# EAGLE design TG-Watch02B-rev02-order01 (EAGLE 9.6.2)
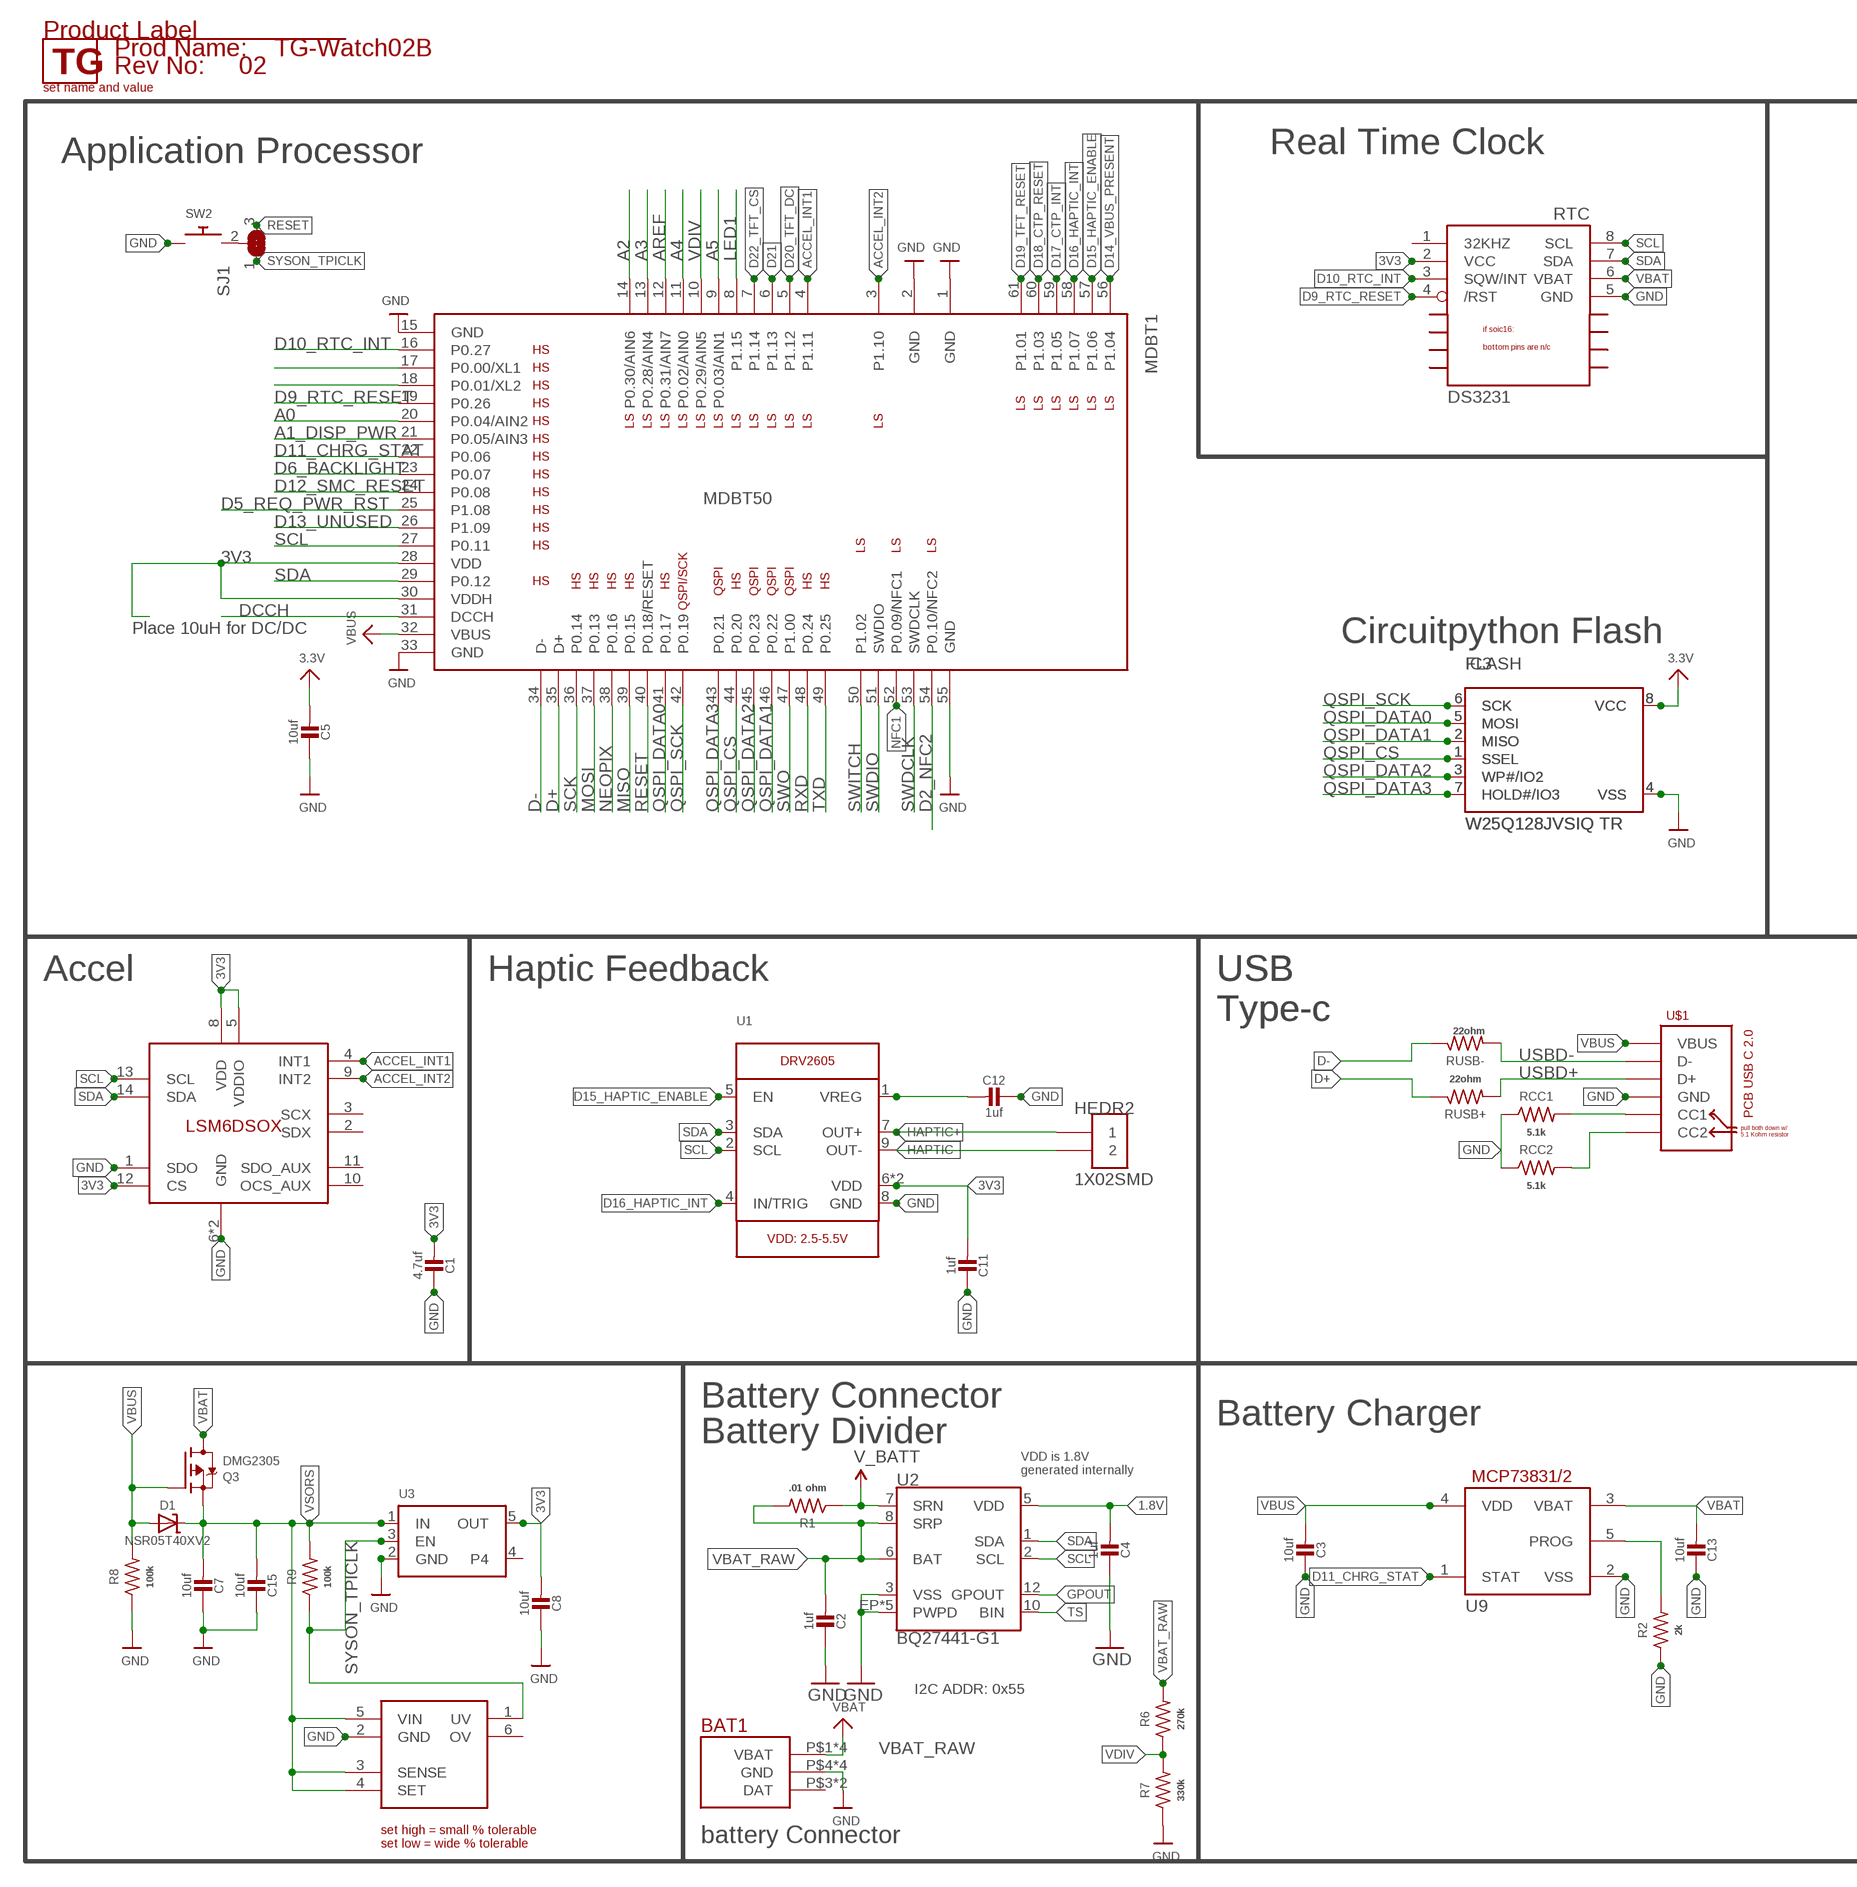
[diagram p0: schematic, sheet 1, part 1 of 2]
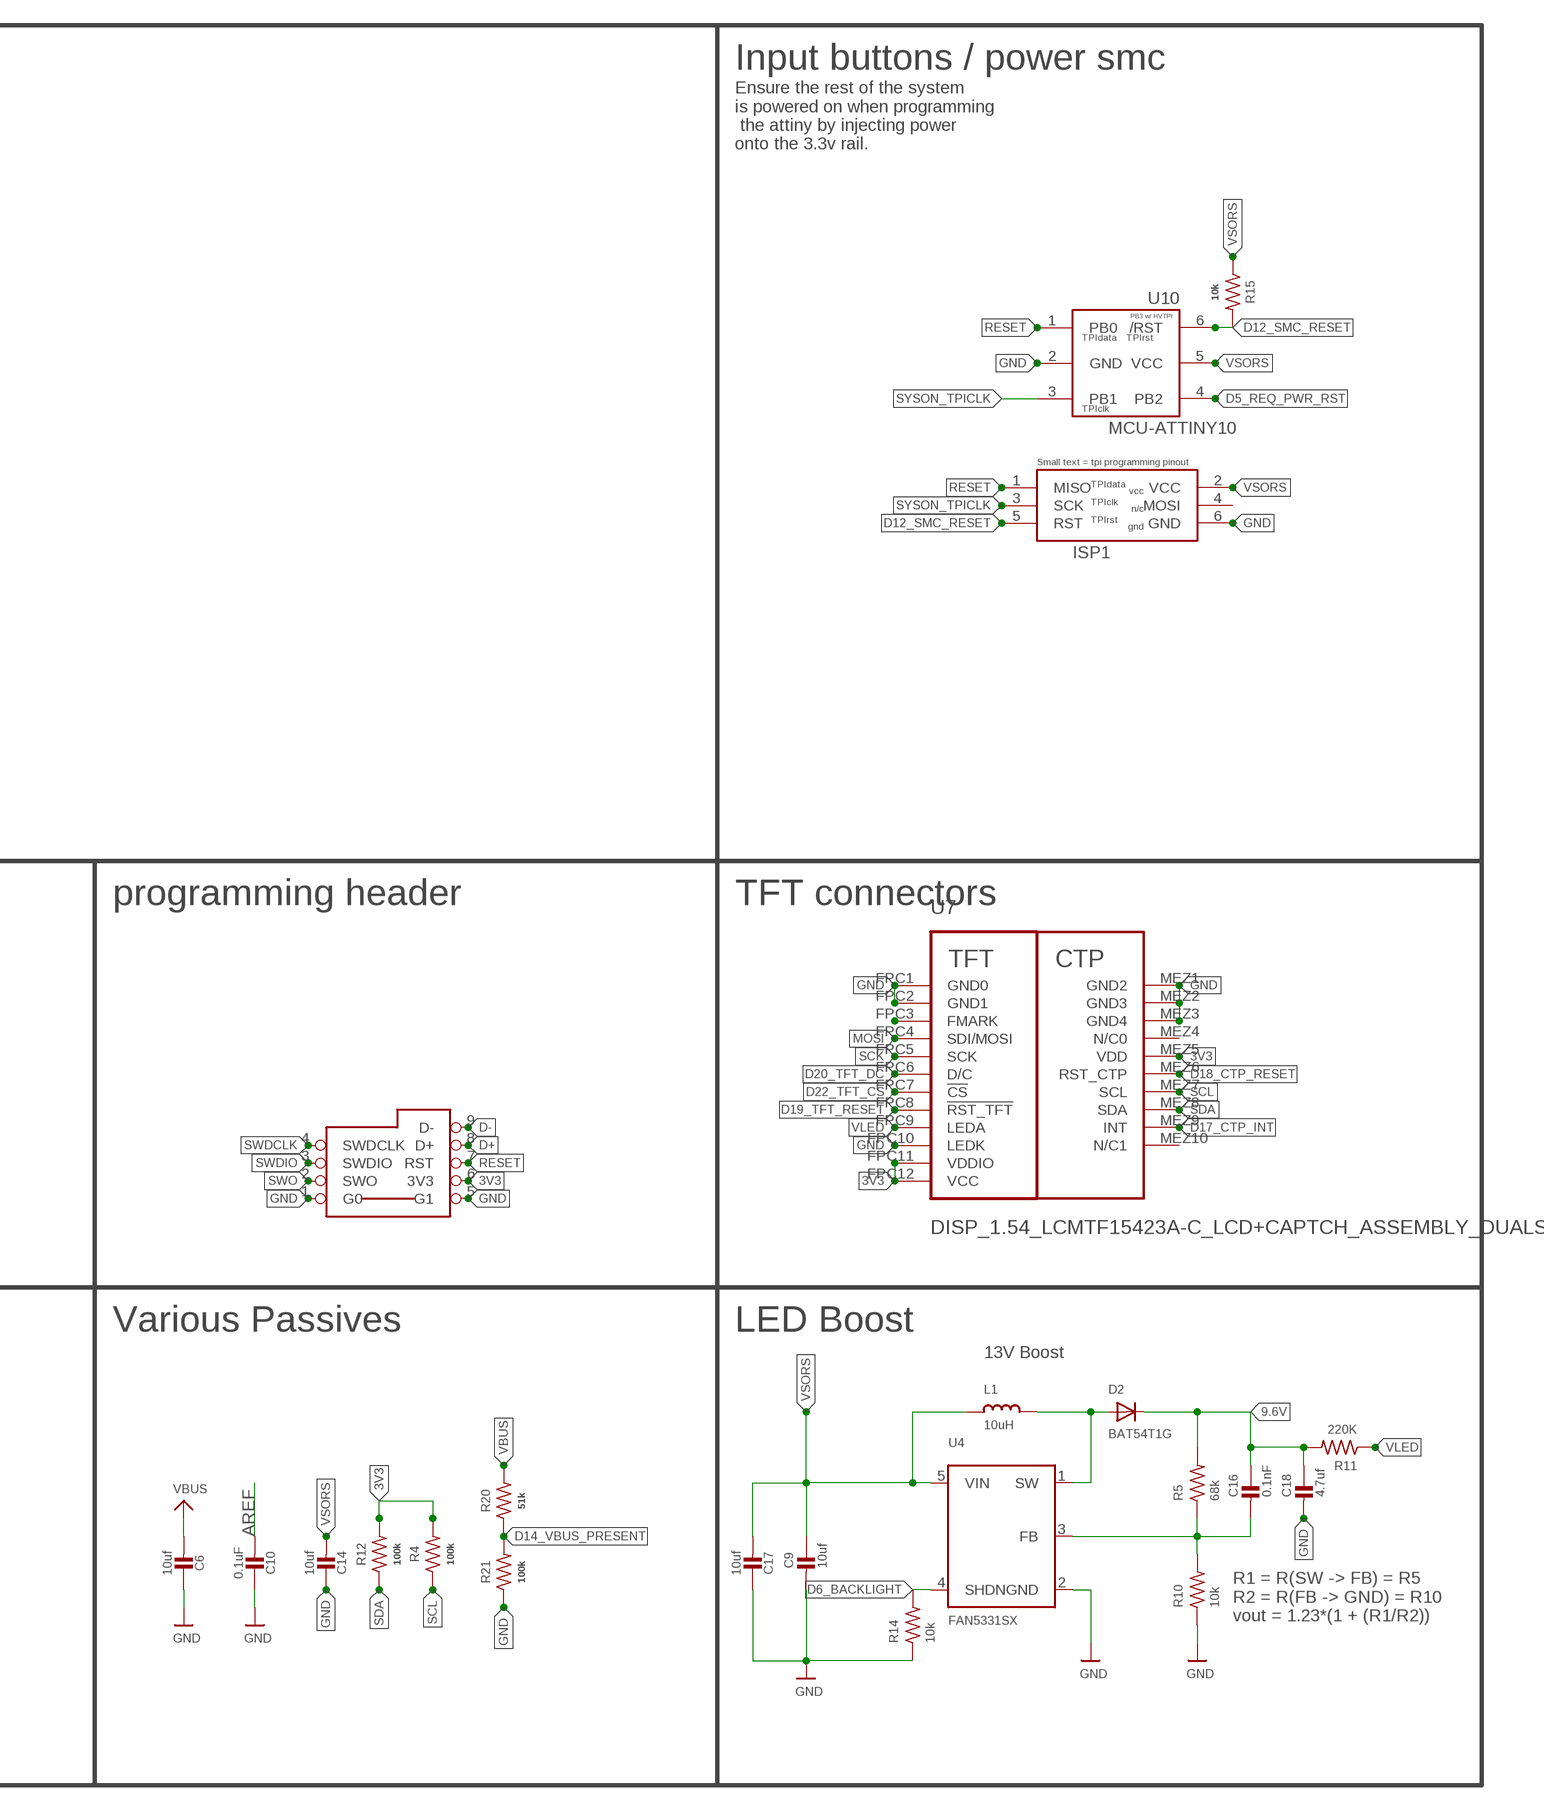
[diagram p1: schematic, sheet 1, part 2 of 2]

## Parts
02  TG-Watch02B  LOGO-TG-PROD-LABEL  [TG-PROD-LABEL-5MM]
ACCEL1  MICROBUILDER_LSM6DSOX  [MICROBUILDER_LGA-14L]
BAT1  CON-BAT-TG-MEZ_FEMALE  [MEZ-DF37NC-10DS]
C1  4.7uf  C-US__0402_NOMASK  [MICROBUILDER__0402_NODIMS]
C2  1uf  C-US__0402_NOMASK  [MICROBUILDER__0402_NODIMS]
C3  10uf  C-US__0402_NOMASK  [MICROBUILDER__0402_NODIMS]
C4  1uf  C-US__0402_NOMASK  [MICROBUILDER__0402_NODIMS]
C5  10uf  C-US__0402_NOMASK  [MICROBUILDER__0402_NODIMS]
C6  10uf  C-US__0402_NOMASK  [MICROBUILDER__0402_NODIMS]
C7  10uf  C-US__0402_NOMASK  [MICROBUILDER__0402_NODIMS]
C8  10uf  C-US__0402_NOMASK  [MICROBUILDER__0402_NODIMS]
C9  10uf  C-US__0402_NOMASK  [MICROBUILDER__0402_NODIMS]
C10  0.1uF  C-US__0402_NOMASK  [MICROBUILDER__0402_NODIMS]
C11  1uf  C-US__0402_NOMASK  [MICROBUILDER__0402_NODIMS]
C12  1uf  C-US__0402_NOMASK  [MICROBUILDER__0402_NODIMS]
C13  10uf  C-US__0402_NOMASK  [MICROBUILDER__0402_NODIMS]
C14  10uf  C-US__0402_NOMASK  [MICROBUILDER__0402_NODIMS]
C15  10uf  C-US__0402_NOMASK  [MICROBUILDER__0402_NODIMS]
C16  0.1nF  C-US__0402_NOMASK  [MICROBUILDER__0402_NODIMS]
C17  10uf  C-US__0402_NOMASK  [MICROBUILDER__0402_NODIMS]
C18  4.7uf  C-US__0402_NOMASK  [MICROBUILDER__0402_NODIMS]
D1  NSR05T40XV2  DIODE-SCHOTTKYSOD-523  [SOD-523]
D2  BAT54T1G  DIODESOD-323  [SOD-323]
FLASH  W25Q128JVSIQ TR  FLASH-SPI-CIRCUIT_PYTHON208MIL  [SOIC8_208MIL]
HEDR2  1X02SMD  [1X2_SMD]
IC3  W25Q128JVSIQ TR  FLASH-SPI-CIRCUIT_PYTHON150MIL  [SOIC8_150MIL]
ISP1  CON-ICSP/ISP-AVR-POGO  [2X3_POGO_AVR]
L1  10uH  INDUCTOR0805  [0805]
MDBT1  MDBT50  [MDBT50]
Q3  DMG2305  MOSFET-P  [SOT23-R]
R1  .01 ohm  R_TG_0402  [TG_0402]
R2  2k  R_TG_0402  [TG_0402]
R4  100k  R_TG_0402  [TG_0402]
R5  68k  R_TG_0402  [TG_0402]
R6  270k  R_TG_0402  [TG_0402]
R7  330k  R_TG_0402  [TG_0402]
R8  100k  R_TG_0402  [TG_0402]
R9  100k  R_TG_0402  [TG_0402]
R10  10k  R_TG_0402  [TG_0402]
R11  220K  R_TG_0402  [TG_0402]
R12  100k  R_TG_0402  [TG_0402]
R14  10k  R_TG_0402  [TG_0402]
R15  10k  R_TG_0402  [TG_0402]
R20  51k  R_TG_0402  [TG_0402]
R21  100k  R_TG_0402  [TG_0402]
RCC1  5.1k  R_TG_0402  [TG_0402]
RCC2  5.1k  R_TG_0402  [TG_0402]
RTC  SEN-TIME-DS3231-(PERSICION-TEMP)  [SOIC8_150MIL]
RUSB+  22ohm  R_TG_0402  [TG_0402]
RUSB-  22ohm  R_TG_0402  [TG_0402]
SJ1  JUMPER_OPEN_2_OP0603  [SOLDERJUMPER_2WAY_OPEN_0603]
SW2  SWITCH_PUSHBUTTONC&K_KSS  [BTN_CK_KSS]
U1  HAPTIC_DRIVER_DRV2605_SOP  [MICROBUILDER_PSOP10]
U2  BQ27441-G1  [PDSO-N12]
U3  VREG_STD_MIN_SOT23-5  [SOT23-5]
U4  FAN5331SX  FAN5331  [SOT23-5@1]
U7  DISP_1.54_LCMTF15423A-C_LCD+CAPTCH_ASSEMBLY_DUALSIDE  [TF-LCM15423A-C_DUALSIDE]
U8  UNDERVOLT-TPS3702CX3  [SOT95P280X110-6N]
U9  MCP73831/OT  [SOT23-5L]
U10  MCU-ATTINY10  [SOT23-6]
U$1  USB-C-CON-TG_MOD-2295018-2.0  [TG_RM_TE_2295018-2]
U$13  CON_SWD_POGO_USB  [SWD_POGO_USB]

## Nets
1.8V: C4.2 U2.5(VDD)
3V3 [power]: ACCEL1.5(VDDIO) ACCEL1.8(VDD) ACCEL1.12(CS) C1.2 C5.2 C8.2 C11.2 FLASH.8(VCC) IC3.8(VCC) MDBT1.28(VDD) MDBT1.30(VDDH) R4.2 R12.2 RTC.2(VCC) U1.6(VDD) U1.10(VDD) U3.5(OUT) U7.FPC11(VDDIO) U7.FPC12(VCC) U7.MEZ5(VDD) U$13.6(3V3) ; supply symbol labelled 3.3V
9.6V: C16.1 C18.1 D2.C R5.2 R11.2
A0: MDBT1.20(P0.04/AIN2)
A1_DISP_PWR: MDBT1.21(P0.05/AIN3)
A2: MDBT1.14(P0.30/AIN6)
A3: MDBT1.13(P0.28/AIN4)
A4: MDBT1.11(P0.02/AIN0)
A5: MDBT1.9(P0.03/AIN1)
ACCEL_INT1: ACCEL1.4(INT1) MDBT1.4(P1.11)
ACCEL_INT2: ACCEL1.9(INT2) MDBT1.3(P1.10)
AREF: C10.2 MDBT1.12(P0.31/AIN7)
BAT_CHRG_SET: R2.2 U9.5(PROG)
CC1: RCC1.2 U$1.A5(CC1)
CC2: RCC2.2 U$1.B5(CC2)
D2_NFC2: MDBT1.54(P0.10/NFC2)
D5_REQ_PWR_RST: MDBT1.25(P1.08) U10.4(PB2)
D6_BACKLIGHT: MDBT1.23(P0.07) R14.2 U4.4(SHDN)
D9_RTC_RESET: MDBT1.19(P0.26) RTC.4(/RST)
D10_RTC_INT: MDBT1.16(P0.27) RTC.3(SQW/INT)
D11_CHRG_STAT: MDBT1.22(P0.06) U9.1(STAT)
D12_SMC_RESET: ISP1.5(RST) MDBT1.24(P0.08) R15.2 U10.6(/RST)
D13_UNUSED: MDBT1.26(P1.09)
D14_VBUS_PRESENT: MDBT1.56(P1.04) R20.1 R21.2
D15_HAPTIC_ENABLE: MDBT1.57(P1.06) U1.5(EN)
D16_HAPTIC_INT: MDBT1.58(P1.07) U1.4(IN/TRIG)
D17_CTP_INT: MDBT1.59(P1.05) U7.MEZ9(INT)
D18_CTP_RESET: MDBT1.60(P1.03) U7.MEZ6(RST_CTP)
D19_TFT_RESET: MDBT1.61(P1.01) U7.FPC8(!RST_TFT)
D20_TFT_DC: MDBT1.5(P1.12) U7.FPC6(D/C)
D21: MDBT1.6(P1.13)
D22_TFT_CS: MDBT1.7(P1.14) U7.FPC7(!CS)
D+: MDBT1.35(D+) RUSB+.1 U$13.8(D+)
D-: MDBT1.34(D-) RUSB-.1 U$13.9(D-)
DCCH: MDBT1.31(DCCH)
DRV_REG: C12.2 U1.1(VREG)
GND: ACCEL1.1(SDO) ACCEL1.6(GND) ACCEL1.7(GND) BAT1.P$4(GND) BAT1.P$5(GND) BAT1.P$9(GND) BAT1.P$10(GND) C1.1 C2.1 C3.1 C4.1 C5.1 C6.1 C7.1 C8.1 C9.2 C10.1 C11.1 C12.1 C13.1 C14.1 C15.1 C17.1 C18.2 FLASH.4(VSS) IC3.4(VSS) ISP1.6(GND) MDBT1.1(GND) MDBT1.2(GND) MDBT1.15(GND) MDBT1.33(GND) MDBT1.55(GND) R2.1 R7.1 R8.1 R10.1 R14.1 R21.1 RCC1.1 RCC2.1 RTC.5(GND) SW2.P$1 U1.8(GND) U2.3(VSS) U2.EP1(PWPD) U2.EP2(PWPD) U2.EP3(PWPD) U2.EP4(PWPD) U2.EP(PWPD) U3.2(GND) U4.2(GND) U7.FPC1(GND0) U7.FPC2(GND1) U7.FPC10(LEDK) U7.MEZ1(GND2) U7.MEZ2(GND3) U7.MEZ3(GND4) U8.2(GND) U9.2(VSS) U10.2(GND) U$1.A1(GND) U$1.A12(GND) U$1.B1(GND) U$1.B12(GND) U$1.P1_1(GND) U$1.P1_2(GND) U$1.P2_1(GND) U$1.P2_2(GND) U$1.P4(GND) U$1.P5(GND) U$13.1(G0) U$13.5(G1)
GPOUT: U2.12(GPOUT)
HAPTIC+: HEDR2.1 U1.7(OUT+)
HAPTIC-: HEDR2.2 U1.9(OUT-)
LED1: MDBT1.8(P1.15)
MISO: MDBT1.39(P0.15)
MOSI: MDBT1.37(P0.13) U7.FPC4(SDI/MOSI)
N$1: U7.FPC3(FMARK)
N$3: C16.2 R5.1 R10.2 U4.3(FB)
N$5: D2.A L1.2 U4.1(SW)
N$6: SJ1.2 SW2.P$2
N$7: MDBT1.17(P0.00/XL1)
N$8: MDBT1.18(P0.01/XL2)
NEOPIX: MDBT1.38(P0.16)
NFC1: MDBT1.52(P0.09/NFC1)
QSPI_CS: FLASH.1(SSEL) IC3.1(SSEL) MDBT1.44(P0.20)
QSPI_DATA0: FLASH.5(MOSI) IC3.5(MOSI) MDBT1.41(P0.17)
QSPI_DATA1: FLASH.2(MISO) IC3.2(MISO) MDBT1.46(P0.22)
QSPI_DATA2: FLASH.3(WP#/IO2) IC3.3(WP#/IO2) MDBT1.45(P0.23)
QSPI_DATA3: FLASH.7(HOLD#/IO3) IC3.7(HOLD#/IO3) MDBT1.43(P0.21)
QSPI_SCK: FLASH.6(SCK) IC3.6(SCK) MDBT1.42(P0.19)
RESET: ISP1.1(MISO) MDBT1.40(P0.18/RESET) SJ1.3 U10.1(PB0) U$13.7(RST)
RXD: MDBT1.48(P0.24)
SCK: MDBT1.36(P0.14) U7.FPC5(SCK)
SCL: ACCEL1.13(SCL) MDBT1.27(P0.11) R4.1 RTC.8(SCL) U1.2(SCL) U2.2(SCL) U7.MEZ7(SCL)
SDA: ACCEL1.14(SDA) MDBT1.29(P0.12) R12.1 RTC.7(SDA) U1.3(SDA) U2.1(SDA) U7.MEZ8(SDA)
SWDCLK: MDBT1.53(SWDCLK) U$13.4(SWDCLK)
SWDIO: MDBT1.51(SWDIO) U$13.3(SWDIO)
SWITCH: MDBT1.50(P1.02)
SWO: MDBT1.47(P1.00) U$13.2(SWO)
SYSON_TPICLK: ISP1.3(SCK) R9.1 SJ1.1 U3.3(EN) U8.1(UV) U10.3(PB1)
TS: U2.10(BIN)
TXD: MDBT1.49(P0.25)
USBD+: RUSB+.2 U$1.A6(D+) U$1.B6(D+)
USBD-: RUSB-.2 U$1.A7(D-) U$1.B7(D-)
VBAT [power]: C13.2 Q3.3(D) R1.1 RTC.6(VBAT) U2.7(SRN) U9.3(VBAT) ; supply symbol labelled V_BATT
VBAT_RAW [power]: BAT1.P$1(VBAT) BAT1.P$2(VBAT) BAT1.P$6(VBAT) BAT1.P$7(VBAT) C2.2 R1.2 R6.2 U2.6(BAT) U2.8(SRP) ; supply symbol labelled VBAT
VBUS [power]: C3.2 C6.2 D1.A MDBT1.32(VBUS) Q3.1(G) R8.2 R20.2 U9.4(VDD) U$1.A4(VBUS) U$1.A9(VBUS) U$1.B4(VBUS) U$1.B9(VBUS)
VDIV: MDBT1.10(P0.29/AIN5) R6.1 R7.2
VLED: R11.1 U7.FPC9(LEDA)
VSORS: C7.2 C9.1 C14.2 C15.2 C17.2 D1.K(C) ISP1.2(VCC) L1.1 Q3.2(S) R9.2 R15.1 U3.1(IN) U4.5(VIN) U8.3(SENSE) U8.4(SET) U8.5(VIN) U10.5(VCC)
Unconnected: ACCEL1.2(SDX) ACCEL1.3(SCX) ACCEL1.10(OCS_AUX) ACCEL1.11(SDO_AUX) BAT1.P$3(DAT) BAT1.P$8(DAT) ISP1.4(MOSI) RTC.1(32KHZ) U3.4 U7.MEZ4(N/C0) U7.MEZ10(N/C1) U8.6(OV)

## Notes on the sheet
- Input buttons / power smc
- Application Processor
- Real Time Clock
- Ensure the rest of the system
  is powered on when programming
   the attiny by injecting power
  onto the 3.3v rail.
- Circuitpython Flash
- Place 10uH for DC/DC
- Accel | Haptic Feedback
- USB
  Type-c
- USB
  Type-c
- programming header | TFT connectors
- Battery Connector | Various Passives | LED Boost
- Battery Charger
- Battery Divider
- 13V Boost
- VDD is 1.8V
  generated internally
- R1 = R(SW -> FB) = R5
  R2 = R(FB -> GND) = R10
  vout = 1.23*(1 + (R1/R2))
- I2C ADDR: 0x55
- battery Connector

## Library data of the parts
02 = 0TG-Lib v01.5:LOGO-TG-PROD-LABEL
ACCEL1 = lsm6dsox_ism330dhc:MICROBUILDER_LSM6DSOX
BAT1 = 0TG-Lib v01.5:CON-BAT-TG-MEZ
C1-C18 = 0TG-Lib v01.5:C-US_: from: microbuilder Ceramic Capacitors For new designs, use the packages preceded by an '_' character since they are more reliable: The following footprints should be used on most boards: _0402 - Standard footprint for regular board layouts _0603 - Standard footprint for regular board layouts _0805 - Standard footprint for regular board layouts _1206 - Standard footprint for regular board layouts For extremely tight-pitch boards where space is at a premium, the following 'micro-pitch' footprints can be used (smaller pads, no silkscreen outline, etc.): _0402MP - Micro-pitch footprint for very dense/compact boards _0603MP - Micro-pitch footprint for very dense/compact boards _0805MP - Micro-pitch footprint for very dense/compact boards _1206MP - Micro-pitch footprint for very dense/compact boards
D1 = microbuilder:DIODE-SCHOTTKY
D2 = microbuilder:DIODE: Diode SMA Model Volts Amps Type Vf Ir Digikey # Notes SSA34-E3 40V 3A Schottky 480mV @ 3A 200uA @ 40V SSA34-E3/61TGITR-ND CDBA120-G 20V 1A Schottky 500mV @ 1A 500uA @ 20V 641-1014-6-ND REEL MBRA210 10V 2A Schottky 350mV @ 2A 700uA @ 10V MBRA210LT3 SOD-123 Model Volts Amps Type Vf Ir Order # Notes BAT54T1G 30V 200mA Schottky 800mV @ 200mA 2uA @ 25V BAT54T1GOSTR-ND B0530W 30V 500mA Schottky 430mV @ 500mA 130uA @ 30V B0530W-FDICT-ND REEL MBR120 20V 1A Schottky 340mV @ 1A MBR120VLSFT1GOSCT-ND SOD-323 Model Volts Amps Type Vf Ir Order # Notes PMEG2005EJ 20V 500mA Schottky 355mV @ 500mA 568-4110-1-ND ZLLS410 10V 570mA Schottky 380mV @ 570mA ZLLS410CT-ND 1N4148WS 75V 150mA Silicon/Simple 1V 1N4148WSFSCT-ND REEL SOD-523 Model Volts Amps Type Vf Ir Order # Notes BAT54XV2 30V 200mA Schottky 0.8V @ 100mA BAT54XV2CT-ND TB751S 30V 30mA Schottky RB751S-40TE61CT-ND SOT23-R/W (R = Solder Paste/Reflow Ovens, W = Hand-Soldering) Model Volts Amps Type Vf Ir Order # Notes BAT54FILM 40V 300mA Schottky 497-7162-1-ND POWERDI-5 Model Volts Amps Type Vf Ir Order # Notes PDS560 60V 5A Schottky 670mV @ 5A 150uA @ 60V PDS560DICT-ND
FLASH IC3 = 0TG-Lib v01.4:FLASH-SPI-CIRCUIT_PYTHON: SOIC8 SPI Flash Be careful with the size since SOIC8 flash comes in several 'widths' SOIC8 150 mil M25P16 - 16Mbit (2Mbit x 8) Serial Flash (75MHz SPI Bus), Supply: 2.7-3.6V Digikey: SOIC8 - M25P16-VMN6P-ND SOIC8 208 mil W25Q16BVSSIG - 16Mbit (2Mbit x 8) Serial Flash (104MHz SPI Bus), Supply: 2.7-3.6V Digikey: SOIC8 - W25Q16BVSSIG-ND from: adafruit availability low
HEDR2 = 0TG-Lib v01.4:1X02
ISP1 = 0TG-Lib v01.5:CON-ICSP/ISP-AVR: AVR ISP HEADER Standard 6 pin header for AVR programming
L1 = microbuilder:INDUCTOR: Inductors 0603: 10nH Ceramic Inductor - microwire antenna/RF (Digikey: 712-1434-2-ND) 0805: 560nH Ceramic Inductor - RF (Digikey: 553-1047-1-ND) 270nH Ceramic Inductor - Q = 40@250MHz, +-5%, 1 Ohm DC Resistance (Digikey: 535-10506-2-ND) 1007 (2518 Metric) SMT: 10µH 10% 250mOhm 820mA 1007 Inductor (Digikey: 587-2189-1-ND) 22µH 10% 500mOhm 580mA 1007 Inductor (Digikey: 587-2190-1-ND) 47µH 10% 950mOhm 420mA 1007 Inductor (Digikey: 587-2191-1-ND) 47µH 5% 100mOhm 1A 1008 Inductor (Digikey: 732-1816-1-ND) 5.0x5.0mm (Taiyo Yuden NR5040 Series) 6.8µH 20% 2.3A 64mOhm Inductor (Digikey: 587-2374-2-ND) 5.0x5.0mm (TDK VLC5045 Series) 4.7µH 20% 3.3A 34mOhm Inductor (Digikey: 445-6526-1-ND) 6.8µH 20% 2.7A 46mOhm Inductor (Digikey: 445-6527-1-ND) 6.0x6.0mm (TDK VLC6045 Series) 4.7µH 20% 3.8A 27mOhm Inductor (Digikey: 445-6538-2-ND) 6.8µH 20% 3A 41mOhm Inductor (Digikey: 445-6540-1-ND) 6.2µH 30% 2.2A 45mOhm Inductor (Digikey: SRR5028-6R2YCT-ND) - Not TDK VLC6045 but footprint should match 6.0x6.0mm (TDK SLF6045 Series) 6.8uH 30% 2A 33mOhm Inductor (Digikey: 445-4572-1-ND, Mouser: 810-SLF645T6R8N2R0PF) 6.0x6.0mm (Sumida CDRH5D28 Series) 6.2uH 30% 1.8A 45mOhm Inductor (Digikey: 308-1542-1-ND) Taiyo Yuden NR3015T2R2M - 2.2uH 20% 1.5A (Digikey: 587-1648-2-ND, Mouser: 963-NR3015T2R2M) - Used with TI TPS62172 CoilCraft RFID Transponder Coil - MA5532-AE (For use with AS3935 Lightning Sensor)
MDBT1 = microbuilder:MDBT50: Raytac Corporation MDBT50 Bluetooth Low Energy Module based on Noridc nRF52840 Source: Raytac datasheet
Q3 = microbuilder:MOSFET-P: P-Channel Mosfet LEGEND VDS: Voltage Drain-Source ID: Drain Current RDS(ON): Drain-Source On-State Resistance VGS(TH): Gate-Source Threshold Voltage CISS: Drain-Source Input Capacitance SOT-23 Name VDS ID RDS(ON) VGS(TH) CISS Order Number IRLML5103 30V 760mA 600 mOhm -- 75pF @ 25V Digikey: IRLML5103PBFCT-ND IRLML6401 12V 4.3A 50 mOhm 950mV @ 250µA 830pF @ 10V Digikey: IRLML6401PBFTR-ND NTR0202PL 20V 400mA 800 mOhm 2.3V @ 250uA 70pF @ 5V Digikey: NTR0202PLT1GOSTR-ND NTR4101PT1G 20V 1.8A 85 mOhm 1.2V @ 250uA 675pF @ 10V Digikey: NTR4101PT1GOSCT-ND DMP2004K 20V 600mA 900 mOhm 1V @ 250uA 175pF @ 16V Digikey: DMP2004KDICT-ND PMV65XP 20V 3.9A 76 mOhm 950mV @ 1mA 725pF @ 20V Digikey: 568-2358-2-ND TO-252 Name VDS ID RDS(ON) VGS(TH) CISS Order Number AOD417 30V 25A 34 mOhm 3V @ 250µA 920pF @ 15V Digikey: 785-1106-2-ND PowerPak Name VDS ID RDS(ON) VGS(TH) CISS Order Number AON7401 30V 12A 14 mOhm 3V @ 250µA 2600pF @ 15V Digikey: 785-1302-1-ND
R1 R2 R4-R12 R14 R15 R20 R21 RCC1 RCC2 RUSB+ RUSB- = 0TG-Lib v01.5:R_TG
RTC = 0TG-Lib v01.5:SEN-TIME-DS3231-(PERSICION-TEMP): from: adafruit altered for this library by: TG-Techie
SJ1 = 0TG-Lib v01.5:JUMPER_OPEN_2_OP: 2-Way Solder Jumper from: microbuilder
SW2 = 0TG-Lib v01.5:SWITCH_PUSHBUTTON: Buttons SOFTTOUCHSMD_SJ - Soft touch temporary push button (Super Junk Akihabara) Compatible with SKPMANE010 [Mouser: 688-SKPMAN] C&K_KSS = Digikey: KSS221GLFS
U1 = 0TG-Lib v01.4:HAPTIC_DRIVER_DRV2605: DRV2605 - Haptic Driver for ERM/LRA Motors
U2 = battery-management-temp:BQ27441-G1; PROD_ID: IC-13220
U3 = 0TG-Lib v01.4:VREG_STD_MIN_SOT23-5: SOT23-5 Fixed Voltage Regulators from: adafruit Part Current Out V Out V In V Dropout θJA (°C/W) TJ (°C) Digikey Part No. ADP121 150mA 3.3V 3.4-5.5V 0.09V @ 150mA -- -- ADP121-AUJZ33R7CT-ND ADP121 150mA 3.0V 3.1-5.5V 0.09V @ 150mA -- -- ADP121-AUJZ30R7CT-ND ADP122 300mA 3.3V 3.4-5.5V 0.085V @ 300mA -- -- ADP122AUJZ-3.3-R7CT-ND ADP1712 300mA 3.3V 3.5-5.5V 0.17V @ 300mA -- -- ADP1712AUJZ-3.3-R7TR-ND AP7311 (Low Cost) 150mA 3.3V 3.5-6V 0.15V @ 150mA -- -- AP7311-33WG-7DICT-ND LD39015M18R 150mA 1.8V 1.9V-5.5V 0.08V @ 100mA -- -- 497-6977-1-ND LP2985A-33DBVR 150mA 3.3V 3.3-16V 0.28V @ 150mA 206 150 296-18479-1-ND MCP1824T-3302E/OT 300mA 3.3V 3.5V-6V 0.2V @ 300mA -- -- MCP1824T-3302E/OTCT-ND MIC5205-2.5YM5 TR 150mA 2.5V 2.7-16V 0.165V @ 150mA -- -- 576-1257-2-ND MIC5205-3.0YM5 TR 150mA 3.0V 3.2V-16V 0.165V @ 150mA -- -- 576-1258-2-ND MIC5205-3.3YM5 TR 150mA 3.3V 3.5V-16V 0.165V @ 150mA -- -- 576-1259-2-ND TPS780330220 150mA 3.3V+2.2V 3.6-5.5V 250mV Max -- -- 296-23332-1-ND TDA3663/N1,135 100mA 3.3V 3.5-45V 0.18V @ 50mA -- -- 568-5343-1-ND Max operating temp can be calculated using θJA, TJ (max junction temperature), and power in watts. Set the "Maximum Ambient Temperature" until it reaches TJ ("Max Junction Temperature"), which is the absolute limit for safe use of the regulator: Heat Sink Temperature Calculator <http://www.daycounter.com/Calculators/Heat-Sink-Temperature-Calculator.phtml> For example, With 12V source into a 3.3V LP2985 and a 30mA load, we are dissipating (12V-3.3V) * 0.03A = 0.261W. With a θJA of 206 °C/W, a TJ of 150°C, and 261mW we can safely use the chip without a heat sink up to 75°C (=147.1°C Junction Temperature).
U4 = microbuilder:FAN5331: FAN5331 - LED/OLED 20V Boost Converter Digikey: FAN5331SXCT-ND
U7 = 0TG-Lib v01.5:DISP_1.54_LCMTF15423A-C_LCD+CAPTCH_ASSEMBLY: FFC/FPC CONNECTOR, RECEPTACLE 12POS 1ROW
U8 = 0TG-Lib v01.4:UNDERVOLT-TPS3702CX3
U9 = 00adafruit:MCP73831: MCP73831/2 Miniature Single-Cell, Fully Integrated Li-Ion, Li-Polymer Charge Management Controllers. Nice and small simple lipoly charge controller, with adjustable current and status output (LED) http://www.ladyada.net/library/pcb/eaglelibrary.html
U10 = 0TG-Lib v01.5:MCU-ATTINY10: ATtiny4/5/9/10 8-bit Microcontroller with 512/1024 Bytes In-System Programmable Flash
U$1 = 0TG-Lib v01.5:USB-C-CON-TG_MOD-2295018-2.0
U$13 = 0TG-Lib v01.5:CON_SWD_POGO_USB

## Net classes
1 power: width 0.254 mm

## Board
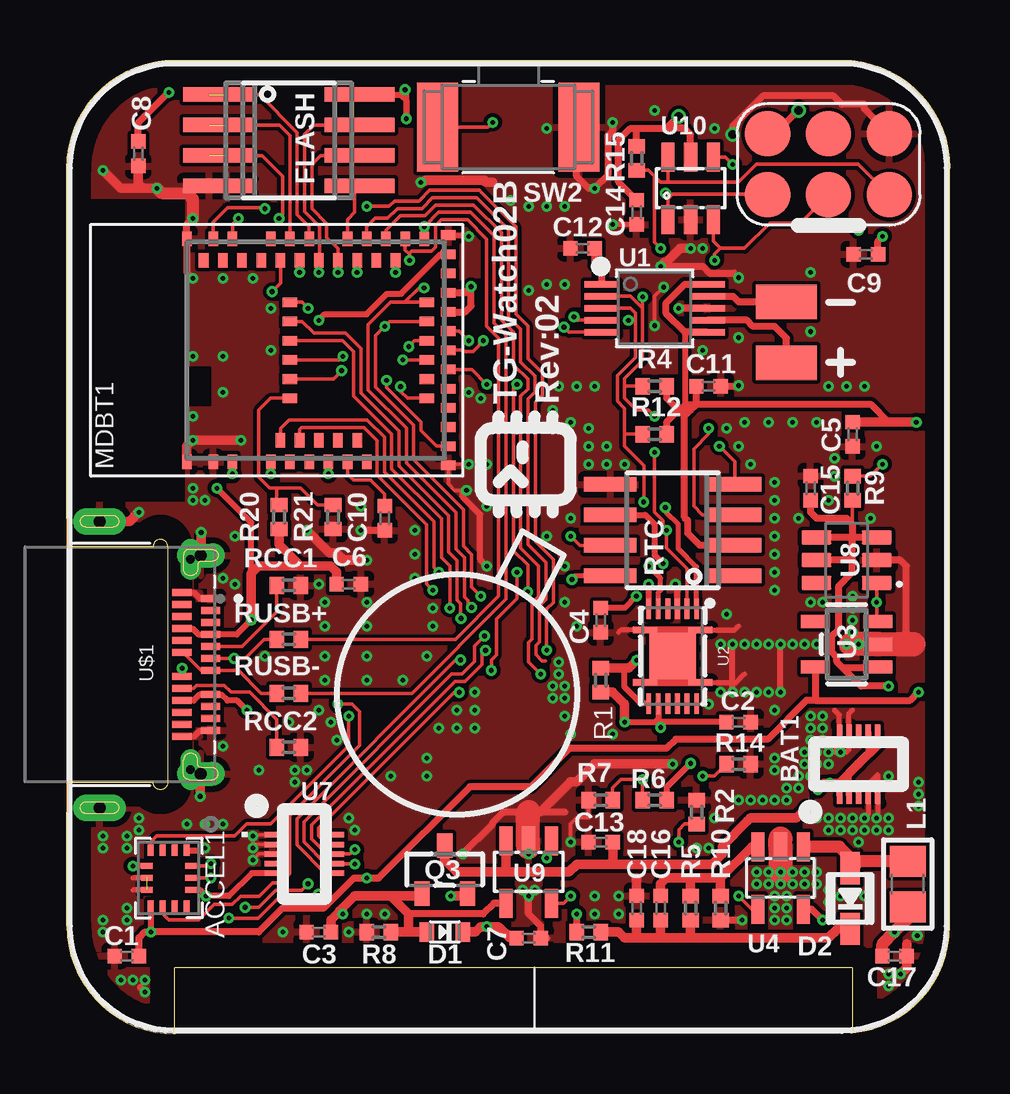
[diagram p2: board, top side]
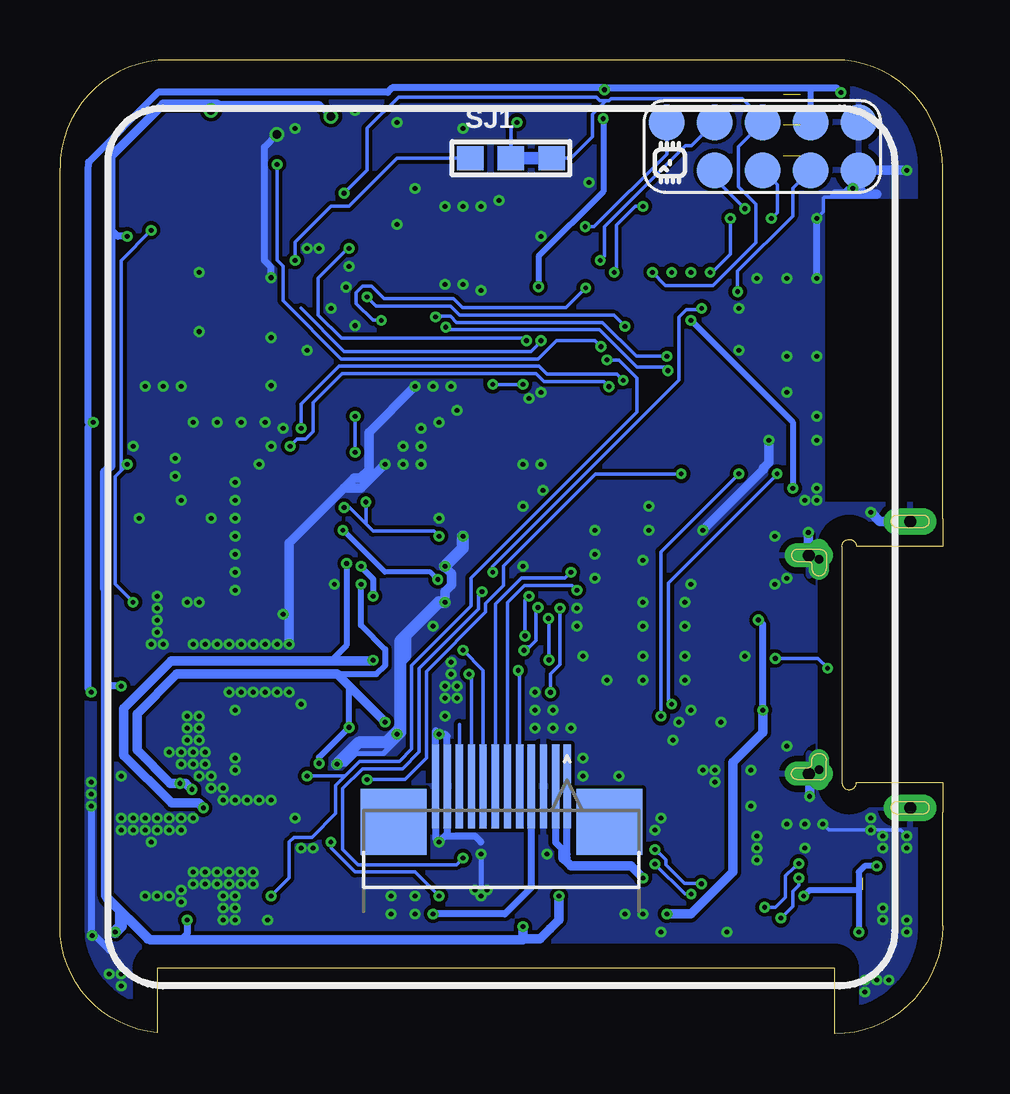
[diagram p3: board, bottom side, seen from below]

Size 36.8 x 40.6 mm. Coordinates in mm from the lower left corner, seen from the top.
Outline: 0,9.23 0,4.5 arc90 4.5,0 4.5,2.75 32.75,2.75 32.75,0.05 arc85 36.8,4.5 36.8,36.1 arc90 32.3,40.6 4.5,40.6 arc90 0,36.1 0,21.49
Copper layers (1*16): Top 0.035mm / dielectric 0.53mm / Bottom 0.035mm
Design rules "default *": minimum track width 6mil, minimum drill 0.2mm, track to track 6mil, track to pad 6mil, pad to pad 6mil, via to via 6mil, smd to smd 6mil, copper to edge 40mil, drill to drill 6mil, minimum pad ring 10mil, minimum via ring 0.125mm, stop-mask expansion 4mil, vias tented up to drill 10000mil, thermal gap 10mil
tRestrict: area 8.3,7.7 to 8.8,8.6; area -0.6,22.2 to 4.9,34.8; area 3,5.8 to 3.8,6.8; area 4.8,7.2 to 5.5,8; area 31.9,12.2 to 32.8,13; area 33.2,9.6 to 34.1,10.3
bRestrict: area -0.6,22.2 to 4.9,34.8; area 20.5,10 to 21.2,10.8

### Footprints (pad centres in the part's own frame; a part is rotated, then mirrored left to right if it is on the bottom)
MICROBUILDER_LGA-14L = smd 0.475 x 0.25: 1 -1.163,0.75; 2 -1.163,0.25; 3 -1.163,-0.25; 4 -1.163,-0.75; 8 1.163,-0.75; 9 1.163,-0.25; 10 1.163,0.25; 11 1.163,0.75 | smd 0.25 x 0.475: 5 -0.5,-0.912; 6 0,-0.912; 7 0.5,-0.912; 12 0.5,0.912; 13 0,0.912; 14 -0.5,0.912
MEZ-DF37NC-10DS = smd 0.23 x 0.63: P$1 -0.8,-1.335; P$2 -0.4,-1.335; P$3 0,-1.335; P$4 0.4,-1.335; P$5 0.8,-1.335; P$6 0.8,1.335; P$7 0.4,1.335; P$8 0,1.335; P$9 -0.4,1.335; P$10 -0.8,1.335
MICROBUILDER__0402_NODIMS = smd 0.6 x 0.6: 1 -0.508,0; 2 0.508,0
SOD-523 = smd 0.8 x 0.6: A 0,-0.75; K 0,0.75
SOD-323 = smd 1.35 x 0.8: A 1.27,0; C -1.27,0
SOIC8_208MIL = smd 0.6 x 2.2: 1 -1.905,-3.315; 2 -0.635,-3.315; 3 0.635,-3.315; 4 1.905,-3.315; 5 1.905,3.315; 6 0.635,3.315; 7 -0.635,3.315; 8 -1.905,3.315
1X2_SMD = smd 1.448 x 2.54: 1 -1.27,0; 2 1.27,0
SOIC8_150MIL = smd 0.6 x 2.2: 1 -1.905,-2.6; 2 -0.635,-2.6; 3 0.635,-2.6; 4 1.905,-2.6; 5 1.905,2.6; 6 0.635,2.6; 7 -0.635,2.6; 8 -1.905,2.6
2X3_POGO_AVR = smd 1.905 x 1.905: 1 -2.54,-1.27; 2 -2.54,1.27; 3 0,-1.27; 4 0,1.27; 5 2.54,-1.27; 6 2.54,1.27
0805 = smd 1.3 x 1.5: 1 -0.95,0; 2 0.95,0
MDBT50 = smd 0.6 x 0.4: 1 -4.65,3.75; 2 -4.65,2.65; 3 -4.65,1.85; 4 -4.65,0.25; 5 -3.75,-0.15; 6 -4.65,-0.55; 7 -3.75,-0.95; 8 -4.65,-1.35; 9 -3.75,-1.75; 10 -4.65,-2.15; 11 -3.75,-2.55; 12 -4.65,-2.95; 13 -3.75,-3.35; 14 -4.65,-3.75; 34 4.65,-6.15; 35 4.65,-5.35; 36 3.75,-4.95; 37 4.65,-4.55; 38 3.75,-4.15; 39 4.65,-3.75; 40 3.75,-3.35; 41 4.65,-2.95; 42 3.75,-2.55; 43 3.75,-1.75; 44 4.65,-1.35; 45 3.75,-0.95; 46 4.65,-0.55; 47 3.75,-0.15; 48 4.65,0.25; 49 3.75,0.65; 50 3.75,1.45; 51 4.65,1.85; 52 3.75,2.25; 53 4.65,2.65; 54 3.75,3.05; 55 4.65,3.75 | smd 0.4 x 0.6: 15 -4.8,-7.15; 16 -4,-7.15; 17 -3.2,-7.15; 18 -2.4,-7.15; 19 -2,-6.25; 20 -1.6,-7.15; 21 -1.2,-6.25; 22 -0.8,-7.15; 23 -0.4,-6.25; 24 0,-7.15; 25 0.4,-6.25; 26 0.8,-7.15; 27 1.2,-6.25; 28 1.6,-7.15; 29 2,-6.25; 30 2.4,-7.15; 31 3.2,-7.15; 32 4,-7.15; 33 4.8,-7.15; 56 -2,-0.55; 57 -1.2,-0.55; 58 -0.4,-0.55; 59 0.4,-0.55; 60 1.2,-0.55; 61 2,-0.55
SOT23-R = smd 0.635 x 1.016: 1 -0.95,-1; 2 0.95,-1; 3 0,1
TG_0402 = smd 0.6 x 0.7: 1 -0.5,0; 2 0.5,0
SOLDERJUMPER_2WAY_OPEN_0603 = smd 1.1 x 1: 1 -1.7,0; 2 0,0; 3 1.7,0
BTN_CK_KSS = smd 1.7 x 3.7: P$1 -2.95,0; P$2 2.95,0
MICROBUILDER_PSOP10 = smd 0.28 x 1.45: 1 -1,-2.2; 2 -0.5,-2.2; 3 0,-2.2; 4 0.5,-2.2; 5 1,-2.2; 6 1,2.2; 7 0.5,2.2; 8 0,2.2; 9 -0.5,2.2; 10 -1,2.2
PDSO-N12 = smd 0.2 x 0.85: 1 -1,-1.975; 2 -0.6,-1.975; 3 -0.2,-1.975; 4 0.2,-1.975; 5 0.6,-1.975; 6 1,-1.975; 7 1,1.975; 8 0.6,1.975; 9 0.2,1.975; 10 -0.2,1.975; 11 -0.6,1.975; 12 -1,1.975 | smd 1.95 x 1.95: EP 0,0 | smd 1 x 0.25: EP1 -1.15,1.1; EP2 -1.15,-1.1; EP3 1.15,-1.1; EP4 1.15,1.1
SOT23-5 = smd 0.55 x 1.2: 1 -0.95,-1.3; 2 0,-1.3; 3 0.95,-1.3; 4 0.95,1.3; 5 -0.95,1.3
SOT23-5@1 = smd 0.55 x 1.2: 1 -0.95,-1.3; 2 0,-1.3; 3 0.95,-1.3; 4 0.95,1.3; 5 -0.95,1.3
TF-LCM15423A-C_DUALSIDE = smd 0.305 x 3.5 bottom: FPC1 2.743,10.317; FPC2 2.261,10.317; FPC3 1.753,10.317; FPC4 1.245,10.317; FPC5 0.762,10.317; FPC6 0.254,10.317; FPC7 -0.254,10.317; FPC8 -0.762,10.317; FPC9 -1.245,10.317; FPC10 -1.753,10.317; FPC11 -2.261,10.317; FPC12 -2.743,10.317 | smd 0.63 x 0.23: MEZ1 -9.835,8.3; MEZ2 -9.835,7.9; MEZ3 -9.835,7.5; MEZ4 -9.835,7.1; MEZ5 -9.835,6.7; MEZ6 -7.165,6.7; MEZ7 -7.165,7.1; MEZ8 -7.165,7.5; MEZ9 -7.165,7.9; MEZ10 -7.165,8.3 | smd 2.75 x 2.75 bottom: MNT0 -4.5,8.85; MNT1 4.5,8.85
SOT95P280X110-6N = smd 1.25 x 0.59: 1 -1.255,0.95; 2 -1.255,0; 3 -1.255,-0.95; 4 1.255,-0.95; 5 1.255,0; 6 1.255,0.95
SOT23-5L = smd 0.55 x 1.2: 1 -0.95,-1.3; 2 0,-1.3; 3 0.95,-1.3; 4 0.95,1.3; 5 -0.95,1.3
SOT23-6 = smd 0.55 x 1.2: 1 -0.95,-1.3; 2 0,-1.3; 3 0.95,-1.3; 4 0.95,1.3; 5 0,1.3; 6 -0.95,1.3
TG_RM_TE_2295018-2 = smd 0.3 x 0.8: A1 -2.75,4.63; A2 -2.25,4.63; A3 -1.75,4.63; A4 -1.25,4.63; A5 -0.75,4.63; A6 -0.25,4.63; A7 0.25,4.63; A9 1.25,4.63; A10 1.75,4.63; A11 2.25,4.63; A12 2.75,4.63; B1 3,3.43; B2 2.5,3.43; B3 2,3.43; B4 1.5,3.43; B5 1,3.43; B6 0.5,3.43; B7 -0.5,3.43; B8 -1,3.43; B9 -1.5,3.43; B10 -2,3.43; B11 -2.5,3.43; B12 -3,3.43 | drill 0.5 long: P1_1 -4.55,4.22; P2_1 4.55,4.22 | drill 0.35 long: P1_2 -4.391,3.795; P2_2 4.391,3.795 | drill 0.5 pad 1.1 long: P4 -5.97,0; P5 5.97,0
SWD_POGO_USB = smd 1.5 x 1.5: 1 -1,-4; 2 -1,-2; 3 -1,0; 4 -1,2; 5 1,-4; 6 1,-2; 7 1,0; 8 1,2; 9 1,4

### Placement (x,y rotation side)
02  19.25,23.75 90 top
ACCEL1  4.25,6.5 270 top
BAT1  33,11.25 0 top
C1  2.5,3.25 0 top
C2  28,13 180 top
C3  10.5,4.25 0 top
C4  22.25,17.25 90 top
C5  32.75,25 90 top
C6  11.75,18.75 180 top
C7  19.25,4 180 top
C8  2.98,36.69 90 top
C9  33.3,32.5 180 top
C10  13.25,21.5 90 top
C11  26.75,27 180 top
C12  21.5,32.75 0 top
C13  22.25,8 0 top
C14  23.75,34.25 90 top
C15  31,22.75 270 top
C16  24.75,5.25 90 top
C17  34.5,3.25 180 top
C18  23.75,5.25 90 top
D1  15.75,4.25 270 top
D2  32.65,5.65 90 top
FLASH  9.25,37.25 270 top
HEDR2  30,29.25 90 top
IC3  9.25,37.25 270 top
ISP1  31.75,36.25 0 top
L1  35.05,6.25 90 top
MDBT1  8.75,28.5 90 top
Q3  15.75,6.85 0 top
R1  22.25,14.75 270 top
R2  26.25,9.25 270 top
R4  24.5,27 0 top
R5  26,5.25 270 top
R6  24.5,9.75 0 top
R7  22.25,9.75 0 top
R8  13,4.25 0 top
R9  32.75,22.75 270 top
R10  27.25,5.25 90 top
R11  21.75,4.25 0 top
R12  24.5,25 0 top
R14  28,11.25 180 top
R15  23.75,36.5 270 top
R20  8.85,21.55 270 top
R21  11.1,21.55 90 top
RCC1  9.25,18.7 180 top
RCC2  9.25,11.95 180 top
RTC  25.25,21 90 top
RUSB+  9.25,16.45 180 top
RUSB-  9.25,14.2 180 top
SJ1  18,36.5 0 bottom
SW2  18.4,37.8 180 top
U1  24.5,30.25 270 top
U2  25.25,15.75 180 top
U3  32.5,16.25 90 top
U4  29.75,6.5 180 top
U7  18.4,0 0 top
U8  32.5,19.75 180 top
U9  19.25,6.75 180 top
U10  26,35.25 0 top
U$1  1.36,15.4 270 top
U$13  7.5,37 90 bottom

### Tracks (layer width: path | path; a pad name or v marks a point on that pad's centre or on a via)
1.8V  (via drill 0.2)
  Top 0.2: U2.5 24.65,18.4 24.75,18.5 24.75,19 v24.25,19.5
  Top 0.254: v23.75,18.25 23.26,17.76 C4.2
  Bottom 0.254: v24.25,19.5 24.25,19.46 23.75,18.96 v23.75,18.25
3V3  (via drill 0.2)
  Top 0.254: 13.9,39.16 v14.1,39.36 14.15,39.31 v14.15,38.15 14.15,38.9 13.9,39.16 | ACCEL1.8 v3.5,4.25 | ACCEL1.5 v2.75,7 | ACCEL1.12 5.55,6 v5.8,5.75 6.75,5.75 7.7,6.7 U7.MEZ5 | 25.75,29.25 25.75,26.25 | 26,26 25.75,26.25 | 25.75,26.25 26.24,26.25 26.24,26.24 | 13.9,39.16 IC3.8 FLASH.8
  Top 0.3: C1.2 3.01,4.01 3.25,4.25 v3.5,4.25 8,4.25 9,5.25 10.72,5.25 11.97,6.5 v12.5,6.5 13,6.5 16.8,10.3 19.34,10.3 20.94,11.9 25,11.9 25.38,12.29 29.21,12.29 30.83,13.9 31.2,13.9 | C8.2 2.98,37.98 v4.25,39.25 | U1.6 25.75,29.25 24.97,30.03 24.97,30.47 25.75,31.25 U1.10 | 34.25,25.51 33.51,26.25 26.25,26.25 26.24,26.24 | 31.2,13.9 35.15,13.9 v35.5,14.25 | U3.5 31.2,13.9 | R12.2 25,25.5 25.5,26 25,26.5 R4.2 | 25.75,26 26,26 | MDBT1.28 16.6,30.1 16.85,30.35 v16.85,31.15 16.6,30.9 MDBT1.30 | RTC.2 26.39,20.36 25.88,20.87 25.88,21.4 25.75,21.54 25.75,25.75 26,26 | 26,26 26.24,26.24 | 26.24,26.24 C11.2
  Top 0.4: C5.2 34.25,25.51 v35.4,25.51 v35.41,25.5
  Top 0.5: 25.5,26 25.75,26
  Bottom 0.254: v2.75,7 3.25,7 3.5,6.75 3.5,6 | 3.5,6 v3.5,4.25 | v5.8,5.75 5.55,6 3.5,6 | v16.85,31.15 16.85,32.41 14.15,35.11 v14.15,38.15 | U$13.6 5.5,39.43
  Bottom 0.3: 15.75,7.25 15.66,7.34 15.66,7.5 | 15.66,7.5 U7.FPC12 | U7.FPC11 16.14,7.98 15.83,7.67 15.66,7.5 | v4.25,39.25 4.43,39.43 4.5,39.43 5.5,39.43 14.03,39.43 v14.1,39.36 14.18,39.43 22.96,39.43 23.14,39.25 32.71,39.25 35.61,36.35 35.63,36.1 35.63,25.55 35.58,25.5 | v35.5,14.25 35.63,14.38 35.63,25.28 v35.41,25.5
  Bottom 0.4: v12.5,6.5 13,7 15.5,7 15.75,7.25 15.83,7.33 15.83,7.67 | v35.41,25.5 35.58,25.5
9.6V
  Top 0.4: R11.2 23,4.25 23.25,4 23.75,4 | 24.75,4 26,4 | 24.75,4 23.75,4 | C18.1 23.75,4 | C16.1 24.75,4 | R5.2 26,4 | D2.C 32.13,4.38 31.75,4 26,4
ACCEL_INT1  (via drill 0.2)
  Top 0.152: ACCEL1.4 3.5,8 3.75,8.25 5.5,8.25 7,8.25 7.5,8.75 8.5,8.75 11.75,12 v11.75,13.25 | MDBT1.4 v8.5,23.35
  Bottom 0.152: v8.5,23.35 11.75,20.1 v11.75,13.25
ACCEL_INT2  (via drill 0.2)
  Top 0.152: ACCEL1.9 4,5 4.25,4.75 5.5,4.75 6.14,5.39 6.9,5.39 7.24,5.74 8.02,5.74 8.57,6.29 8.91,6.29 9.28,6.66 9.28,9.1 12.2,12.02 12.2,13.43 11.89,13.75 v11.3,13.75 | MDBT1.3 v6.9,23.35
  Bottom 0.152: v6.9,23.35 11.45,18.8 11.45,13.89 v11.3,13.75
AREF
  Top 0.152: MDBT1.12 11.7,23.35 11.95,23.1 12.65,23.1 13.25,22.5 C10.2
BAT_CHRG_SET  (via drill 0.2)
  Top 0.152: U9.5 20.7,5.45 v21,5.75 | v25.5,8 25.5,8.5 25.75,8.75 R2.2
  Bottom 0.152: v21,5.75 22,6.75 24.5,6.75 25.5,7.75 v25.5,8
CC1
  Top 0.152: RCC1.2 8.75,17.6 7.45,16.3 7.3,16.15 U$1.A5
CC2
  Top 0.152: RCC2.2 8.75,13.12 7.62,14.25 6.84,14.25 6.56,14.53 5.42,14.53 5.29,14.4 U$1.B5
D5_REQ_PWR_RST  (via drill 0.2)
  Top 0.152: MDBT1.25 14.5,28.9 v14.25,28.65 | v27.75,36.25 27.45,36.55 U10.4
  Bottom 0.152: v14.25,28.65 14.5,28.9 16.11,28.9 16.87,28.14 25.07,28.14 27.5,30.57 27.5,32 27.75,32.25 v27.75,36.25
D6_BACKLIGHT  (via drill 0.2)
  Top 0.152: MDBT1.23 v14,28.1 | R14.2 27,10.75 v26.5,10.75 | U4.4 28.55,5.2 v28,5.75
  Bottom 0.152: v14,28.1 13.5,28.1 12.75,27.35 12.75,25.93 19.67,19.02 19.67,17.84 22.13,15.37 22.13,11.88 22.65,11.36 24.31,11.36 24.93,10.75 | v28,5.75 27.25,6.5 27.25,8 27.05,8.2 26.3,8.2 25.31,9.19 25.31,10.36 24.93,10.75 | v26.5,10.75 24.93,10.75
D9_RTC_RESET  (via drill 0.2)
  Top 0.152: MDBT1.19 14.19,26.5 13.91,26.78 v13.91,26.99 | RTC.4 27.85,23.85 v27.2,24.5
  Bottom 0.152: v13.91,26.99 14.12,27.2 16.63,27.2 16.96,27.53 25.04,27.53 26.25,26.32 26.25,25.11 26.56,24.8 26.91,24.8 v27.2,24.5
D10_RTC_INT  (via drill 0.2)
  Top 0.152: MDBT1.16 15.4,24.5 14.76,25.14 14.76,25.5 13.32,26.94 v13.32,27.25 | v26.75,25.25 26.75,25 26.13,24.38 26.13,22 26.49,21.64 RTC.3
  Bottom 0.152: v13.32,27.25 13.57,27.5 16.5,27.5 16.84,27.84 25.16,27.84 26.75,26.25 v26.75,25.25
D11_CHRG_STAT  (via drill 0.2)
  Top 0.152: U9.1 20.2,7.53 v20,7.33 | v19.21,18.43 19.21,19.54 18.61,20.14 18.61,26.93 v18.76,27.08 | v17.5,27.08 16.88,27.7 MDBT1.22
  Bottom 0.152: v20,7.33 20.27,7.05 24.37,7.05 25.01,7.69 25.01,10.23 24.19,11.06 22.52,11.06 21.83,11.75 21.83,15.24 19.66,17.41 19.54,17.54 19.36,17.71 19.36,18.28 v19.21,18.43 | v18.76,27.08 v17.5,27.08
D12_SMC_RESET  (via drill 0.2)
  Top 0.152: v17.35,28.9 17.2,28.75 17.2,28.71 16.94,28.45 16.56,28.45 16.51,28.5 MDBT1.24 | ISP1.5 34.75,34.52 34.75,34.5 33,36.25 28.75,36.25 28,35.5 25,35.5 | R15.2 24.25,36 24.5,35.75 | 24.5,35.75 24.75,35.5 25,35.5 | U10.6 25.05,35.55 25,35.5 | v24.75,32.75 24.5,33 24.5,35.75
  Bottom 0.152: v17.35,28.9 17.45,29 25.07,29 26.03,29.97 26.03,31.5 24.78,32.75 v24.75,32.75
D13_UNUSED  (via drill 0.2)
  Top 0.152: MDBT1.26 16.35,29.3 v16.75,28.9
  Bottom 0.152: 26.75,30.25 24.95,28.45 17.16,28.45 16.9,28.71 16.9,28.75 v16.75,28.9
D14_VBUS_PRESENT
  Top 0.152: R21.2 10.45,22.05 9.75,22.75 8.75,22.75 | MDBT1.56 8.5,26.5 8,26 8,23.21 8.46,22.75 8.75,22.75 | R20.1 8.75,22.15 8.75,22.75
D15_HAPTIC_ENABLE  (via drill 0.2)
  Top 0.152: MDBT1.57 11.11,27.3 v11.45,27.65 | v20.72,29.47 20.93,29.25 U1.5
  Bottom 0.152: v11.45,27.65 11.6,27.8 12.76,27.8 14.31,29.35 20.6,29.35 v20.72,29.47
D16_HAPTIC_INT  (via drill 0.2)
  Top 0.152: MDBT1.58 11.35,28.1 v11.5,28.25 | v21.14,29.89 21.28,29.75 U1.4
  Bottom 0.152: v11.5,28.25 12.78,28.25 14.19,29.66 20.27,29.66 20.53,29.92 20.9,29.92 20.93,29.89 v21.14,29.89
D17_CTP_INT  (via drill 0.2)
  Top 0.152: U7.MEZ9 10.85,7.9 10.5,8.25 10.5,8.6 16.15,14.24 v16.36,14.24 | MDBT1.59 11.49,28.9 11.95,28.44 11.95,26.58 13.54,25 13.54,23.55 15.61,21.48 15.61,19.85 15.96,19.5 v15.96,17.75
  Bottom 0.152: v16.36,14.24 16.36,15 15.96,15.4 v15.96,17.75
D18_CTP_RESET  (via drill 0.2)
  Top 0.152: U7.MEZ6 10.76,6.7 9.59,7.87 9.59,8.97 16.2,15.59 v16.41,15.59 | MDBT1.60 9.8,29.7 10.29,29.2 11.62,29.2 12.26,28.56 12.26,26.71 13.84,25.12 13.84,23.68 15.91,21.61 15.91,20.09 16.27,19.73 16.27,18.09 16.41,17.94 16.41,17.34 v16.43,17.32
  Bottom 0.152: v16.41,15.59 16.41,17.3 v16.43,17.32
D19_TFT_RESET  (via drill 0.2)
  Top 0.152: MDBT1.61 9.8,30.5 v10.05,30.25 | v17.69,15.16 17.69,15.58 17.91,15.8 17.91,17.3 18.76,18.15 v18.76,19.25
  Bottom 0.152: v10.05,30.25 10.1,30.2 10.69,30.2 11,29.89 11,27.25 18.5,19.75 18.76,19.49 v18.76,19.25 | U7.FPC8 17.64,15.1 v17.69,15.16
D20_TFT_DC  (via drill 0.2)
  Top 0.152: MDBT1.5 8.9,25.23 9.25,25.58 12.52,25.58 13.23,24.87 13.23,23.43 15.3,21.36 15.3,19.45 v15.5,19.25
  Bottom 0.152: v15.5,19.25 15.74,19.01 17.56,19.01 18.65,17.92 U7.FPC6
D22_TFT_CS  (via drill 0.2)
  Top 0.152: MDBT1.7 9.7,25.2 9.78,25.28 12.39,25.28 12.93,24.75 12.93,23.3 15,21.23 15,18.75 v15.25,18.5
  Bottom 0.152: U7.FPC7 18.15,18 17.44,18.7 15.45,18.7 v15.25,18.5
D+  (via drill 0.2)
  Top 0.152: MDBT1.35 14.1,32.67 14.28,32.5 v14.28,32.25 14.28,32.53 14.37,32.62 15.2,32.62 15.37,32.8 15.37,33.69 15.63,33.95 16.7,33.95 17.5,33.14 17.5,29.5 18,29 18,18.25 16.2,16.45 RUSB+.1
  Bottom 0.152: U$13.8 10.48,37.02 10.73,37.02 14.1,33.65 14.1,32.43 v14.28,32.25
D-  (via drill 0.2)
  Top 0.152: MDBT1.34 v14.9,33.65 15.5,34.25 16.82,34.25 17.8,33.27 17.8,29.63 18.3,29.13 18.3,18.12 14.38,14.2 RUSB-.1
  Bottom 0.152: U$13.9 11.5,36.68 14.53,33.65 v14.9,33.65
DRV_REG
  Top 0.3: C12.2 22,32.05 22.3,31.75 U1.1
GND  (via drill 0.2, 0.35)  (1 unrouted)
  Top 0.152: U7.MEZ3 8,7.5 v7.75,7.25 | U7.MEZ2 7.85,7.9 7.75,8 | U7.MEZ1 7.7,8.3 | v21,8 21,8.75 21.25,9 21.75,9 R7.1 | v16.75,23.75 15.95,23.75 MDBT1.15 15.9,22.92 16.16,22.66 16.5,22.66 | v24.5,29.53 24.5,30.75 v24.88,31.13
  Top 0.2: 33.8,9.17 BAT1.P$5 33.8,10.8 33.4,10.4 BAT1.P$4 33.4,9.15 | 32.5,11.75 32.6,11.85 BAT1.P$9 32.6,13.35 32.75,13.5 | 32,11.75 32.2,11.95 BAT1.P$10 32.2,13.3 32,13.5 | ACCEL1.6 2.75,6.5 | ACCEL1.7 2.75,6 | MDBT1.33 16.7,33.3 v16.75,33.25 | U2.EP1 27.9,14.65 28.25,15 | U2.EP2 27.85,16.85 28,17 | U2.EP3 23.1,16.85 23,16.75 | U2.EP4 25.15,14.65 25.25,14.75 U2.EP | C14.1 v22.76,33.74 v22.75,33.75
  Top 0.254: ACCEL1.1 5.66,7.66 v5.75,7.75 | v17.5,19.5 17.23,19.77 17.23,21.66 16.5,22.39 16.5,22.66 | U2.3 25.45,18.66 v25.36,18.75 | v27.75,14.25 v27.75,16.25 | v29.75,14.25 v29.75,16.25 | U$1.B1 5.3,12.4 5.55,12.65 U$1.A12 | U$1.B12 5.3,18.4 5.55,18.15 U$1.A1
  Top 0.3: 3.06,1.94 v3.25,1.75 | v5.25,34 5,33.75 MDBT1.55 5,31.75 v5.25,31.5 | U3.2 34.5,16.25 35,16.75 35,19.5 34.75,19.75 U8.2 | v16.5,7.5 17.72,8.72 17.72,8.78 18.2,9.25 19.25,9.25 19.75,9.25 20.75,9.25 | v19.25,5.75 19.25,5 19.76,4.49 C7.1 20.01,4 | U1.8 v25.5,30.25 | C10.1 v12.26,20.99 v12.25,21 | v28,27.03 28.04,27.03 28.01,27 C11.1 | R10.1 v28.15,4.75 | ISP1.6 33.25,38.56 33.25,38.75 32.3,38.75 31.94,39.1 29.02,39.1 27.75,37.84 v27.75,37.5 | SW2.P$1 21.25,37.7 21.25,35.75 21.75,35.25 v22,35.25 22.55,35.8 22.55,37.44 22.75,37.64 v22.75,38 | v24.75,32 26.5,32 26.78,31.72 27.8,31.72 v28,31.53
  Top 0.4: C18.2 23.75,6.5 | v1.5,36 2.25,35.25 v3.75,35.25 3.16,35.25 2.98,35.43 C8.1 | v10,21 10.95,20.05 11.23,20.05 11.53,19.75 v12.5,19.75 | v7.25,24.75 v5.25,24.75 5,24.5 MDBT1.1 | v25.25,11.25 22,11.25 21.25,10.5 21,10.5 19.75,9.25 | 17.75,35.5 17.47,35.5 17.38,35.59 14.94,35.59 14.85,35.5 v14.75,35.5 | U$1.P2_2 5.55,10.81 v5.55,9.9 | U$1.P1_2 5.6,20.04 v5.6,20.9 | v3,21.75 2.62,21.37 U$1.P4 | v24.75,32 24.92,32.17 24.99,32.17 25.57,32.75 v26,32.75 | v34.75,2.5 35.01,2.76 C17.1 35.01,3.76
  Top 0.5: v3.75,35.25 3.95,35.05 5,35.05 5.25,34.8 v5.25,34
  Top 1: 19.23,7.8 19.23,9.23 19.25,9.25 | U3.2 35.28,16.25 | U3.2 33.55,16.25 | U3.2 32.69,16.25 | v29.75,6.75 U4.2 29.75,8.15
  Bottom 0.152: v1.5,8.25 1.75,8.5 4.75,8.5 v5,8.75 | v3.75,35.25 4,35.25 4.37,34.88 4.93,34.88 4.98,34.83 4.98,34.27 v5.25,34 | v24.88,31.13 v24.87,31.13 24.75,31.25
  Bottom 0.2: v19.25,7.5 v19.25,5.75 | v25.25,11.25 24.89,11.25 24.45,11.69 23.31,11.69 22.46,12.54 22.46,15.51 22.25,15.72 C4.1
  Bottom 0.3: 20.75,12.5 20.66,12.41 U7.FPC2 20.66,8.34 v21,8 | 21.14,12.64 U7.FPC1 21.14,8.14 v21,8 | 19.25,8 19.5,8.25 20.75,8.25 v21,8 | v35.5,9.5 35.5,4.25 34.75,3.5 | v5.25,31.5 v5.25,34 | v28,31.53 28,31.96 28.28,32.24 28.28,36.97 v27.75,37.5
  Bottom 0.4: v23.25,23.75 24.25,22.75 24.96,22.75 | 24.96,22.75 27.25,20.46 v27.25,16.25 | v22,27 23.92,25.08 23.92,23.51 24.26,23.17 24.54,23.17 24.96,22.75 | v1.5,36 U$13.1 3.5,35.25 3.25,35 | v20.75,18 20.75,18.43 20.47,18.71 20.47,19.19 20.75,19.46 v20.75,19.5 | v10,21 7.48,23.52 7.48,23.59 7.25,23.82 v7.25,24.75 | 3.25,35 2.75,35 | 3.25,35 4.5,35 | U$1.P1_2 5.6,20.04 v5.6,20.9 | U$1.P2_2 5.55,10.81 v5.55,9.9 | U$1.P4 2.62,21.37 v3,21.75
  Bottom 0.5: v25.25,11.25 24.35,12.15 23.21,12.15 22.62,12.74 22.62,16.38 C4.1 21,18 v20.75,18 | v20.75,19.5 20,20.25 v20,20.75
  other vias: 23,5.75 13.25,5 9,4.25 11.75,4.25 12.5,5 7.75,8.25 7.75,7.75 31.75,11.75 35.5,10 15,10.75 15,11.5 28,29.03 31,29.28 26.25,7.75 27,9 26.75,7.75 23,5 22,5 22,5.75 31.25,11.75 31.75,11.25 31.25,11.25 30.75,11.75 31,10.75 31.5,12.25 12.25,22 16.66,22.66 17.5,22 17,13.5 16.25,13.5 17,14.25 10.75,14.75 20.5,15.5 10.75,15.75 12.5,15.75 12.5,14.75 14,14.75 15,15.75 10.5,13.5 9.25,13 11,13 11.25,12.25 5.75,8.75 6.5,8.75 9.5,10.5 9.5,11 10,11 10.75,17 12.5,17 19.25,31 18.5,34.75 17.25,26.5 17.5,23.75 8.5,28.5 8.5,30.25 7.75,31.5 5.25,28.25 5.25,25.75 6.5,26.75 6.5,28.25 27.5,25.25 32,23.25 33.75,24.5 28.75,6.75 29.25,6.75 30.25,6.75 30.75,6.75 30.75,6.25 30.25,6.25 29.75,6.25 29.25,6.25 28.75,6.25 29.5,5.75 30,5.75 30,5.25 29.5,5.25 29.5,4.75 30,4.75 31.25,6.25 31.25,6.75 31.75,6 31.75,5.5 32.25,5.75 32.75,5.75 33.25,5.75 31.75,8.5 31.25,9 32.25,8.5 31.75,9 32.25,9 30,9.75 30.5,10.25 29.5,9.75 30,10.25 30.5,10.75 30.75,11.25 29,9.75 28.5,9.75 28,9.75 32.75,9 33.25,9 33.75,9 34.25,9 34.25,8.5 33.75,8.5 33.25,8.5 32.75,8.5 33,8 31.5,12.75 31.5,13.25 31,13.25 31,12.75 31,12.25 32.25,11.75 15.25,17.75 14.5,19 14.5,20 14.5,21 21.25,17 6.5,31.5 28.25,14.25 28.75,14.25 29.25,14.25 27.25,14.25 28.25,16.25 28.75,16.25 29.25,16.25 30.25,16.25 30.75,16.25 31.25,16.25 21.75,23.75 20.5,27 21.25,27 20,31.25 20.75,31.25 28.5,23.75 28,24.5 29.5,23 29.5,22.25 29.5,21.5 29.5,20.75 29.5,20 29.5,19.25 29.5,18.5 22.5,23.75 21.75,24.5 22.5,24.5 21.75,25.25 21,21.5 21,25.5 20.25,26 20.5,15 20.25,14.5 20.75,14.5 20.25,14 20.75,14 20.75,13.25 20,34.5 19.25,34.5 20.75,34.5 31.75,27 33.25,27 32.5,27 31.25,25.5 30.25,25.5 29.25,25.5 28.25,25.5 31.75,22.25 33.5,21.5 30.5,21.5 32.75,16.75 32.75,17.25 32.75,17.75 32.75,18.25 32.5,16.25 33,16.25 31.5,18 31,18 26.75,13.75 29.5,13.5 29.5,11.5 34.25,10.75 35.5,10.5 34.25,2 34.25,2.5 19,6 19.5,6 3.25,2.25 2.75,2.25 2.25,2.25 1.5,4.25 1.5,4.75 2.5,4.75 2.5,5.25 1.5,7.75 2.5,8.25 2.5,7.75 3,9 3,8.5 17,12.75 16.25,12.75 15.5,12.75 13.5,10.75 15.25,17 10.75,18 12.5,18 32,24 29.5,11 22.75,12.5 21,12.5 11.75,9 12,8.5 8,9.5 8,11 8.25,15.75 10.5,18.75 16.75,26.75 6.5,12 7,18.75 6.5,19 7,20.75 5.25,22.25 5.75,22.25 5.25,22.75 27.5,17.5 26.5,28.5 31,31.75 27,37.75 26.5,32.75 24.5,38.5 20,37.75 35.45,4.1
  pour Top: -0.25,-0.25 -1,41 37.25,41 37.25,-0.5 -0.25,-0.5
  pour Bottom: -0.75,41.5 -1.5,41.5 -1.5,40.75 -1.5,-1 17,-1 37.75,-1 37.75,23.25 37.75,41.5 26,41.5
HAPTIC+
  Top 0.3: HEDR2.1 30,29 29.51,29.49 28.61,29.49 28.35,29.75 U1.7
HAPTIC-
  Top 0.3: U1.9 27.77,30.75 28,30.52 HEDR2.2
MISO
  Top 0.152: MDBT1.39 12.5,33.65 12.85,34 13.37,34 13.78,34.41 14.8,34.41 15.25,34.86 17.07,34.86 17.34,34.59 18.41,33.52 18.41,29.88 18.91,29.38 18.91,28.02 19.52,27.41 19.52,26.76 19.22,26.47 19.22,20.39 19.97,19.64 19.97,18.12 19.7,17.84 19.7,16.34 19.55,16.19 19.55,15.81 19.81,15.55 19.95,15.55
MOSI  (via drill 0.2)
  Top 0.152: MDBT1.37 13.3,33.5 13.9,34.1 14.92,34.1 15.37,34.55 16.95,34.55 18.11,33.39 18.11,29.75 18.61,29.25 18.61,27.89 19.21,27.29 19.21,26.89 18.91,26.59 18.91,20.27 19.67,19.52 19.67,18.25 19.39,17.97 19.39,16.46 19.24,16.31 19.24,15.51 v19.75,15
  Bottom 0.152: U7.FPC4 19.64,15 v19.75,15
N$1
  Bottom 0.152: U7.FPC3 20.15,12.9
N$3
  Top 0.4: C16.2 24.75,6.25 25,6.5 26,6.5 | 27.25,6.5 26,6.5 | R5.1 26,6.5 | R10.2 27.25,6.5 | 27.25,6.5 28.55,7.8 U4.3
N$5
  Top 0.4: D2.A 32.95,7.05 32.2,7.8 | 35,7.25 L1.2
  Top 0.5: L1.2 32.8,7.2 | 32.8,7.2 32.2,7.8 U4.1 | D2.A 32.7,7.1 32.8,7.2
N$6  (via drill 0.2)
  Top 0.152: SW2.P$2 17.55,37.8 v17.75,38
  Bottom 0.152: v17.75,38 18,37.75 SJ1.2
QSPI_CS  (1 unrouted)
  Top 0.152: FLASH.1 8.03,39.16 9.61,37.58 9.61,34.15 10.1,33.65 MDBT1.44
QSPI_DATA0
  Top 0.152: MDBT1.41 11.7,33.95 12,34.25 12,35.2 IC3.5
  Top 0.254: FLASH.5 IC3.5
QSPI_DATA1  (1 unrouted)
  Top 0.152: MDBT1.46 9.3,37.45 8.87,37.88 FLASH.2
QSPI_DATA2  (via drill 0.2)  (1 unrouted)
  Top 0.152: MDBT1.45 v9.7,31.75 | v8.85,34 8.99,34.15 8.99,35.76 8.13,36.62 IC3.3
  Bottom 0.152: v9.7,31.75 9.6,31.75 8.85,32.5 v8.85,34
QSPI_DATA3  (via drill 0.2)
  Top 0.152: v10.5,31.75 MDBT1.43 10.53,32.28 10.53,33.65 9.91,34.27 9.91,37.5 10.29,37.88 11.5,37.88 FLASH.7
  Top 0.254: IC3.7 11.5,37.88
QSPI_SCK  (via drill 0.2)
  Top 0.152: v11.3,31.75 MDBT1.42 11.3,32.73 10.83,33.19 10.83,33.78 10.21,34.4 10.21,36.25 10.58,36.62 FLASH.6
  Top 0.254: IC3.6 FLASH.6
RESET  (via drill 0.2)
  Top 0.152: MDBT1.40 v12.1,31.75 | U10.1 25.05,34.8 25.25,35 | 25.25,35 29.19,35 ISP1.1 | 25.25,35 25,35 v24.95,35.05
  Bottom 0.152: U$13.7 7.77,37.73 | 7.77,37.73 8.52,36.98 8.52,35.31 7.8,34.59 7.8,32.98 9.58,31.2 11.55,31.2 v12.1,31.75 | 7.77,37.73 7.77,38.41 8.35,38.98 13.84,38.98 13.91,38.91 14.04,38.91 | v24.95,35.05 24,36 24,37.75 22.7,39.05 14.44,39.05 14.29,38.91 14.04,38.91 | SJ1.3 15.5,36.5 14.6,37.4 14.6,38.34 14.04,38.9 14.04,38.91
SCK  (via drill 0.2)
  Top 0.152: MDBT1.36 v13.7,31.75 | v12.5,34.5 13.44,34.5 13.65,34.71 13.75,34.71 13.87,34.71 14.67,34.71 15.12,35.16 17.2,35.16 17.31,35.06 18.72,33.65 18.72,30 19.22,29.5 19.22,28.14 19.82,27.54 19.82,26.64 19.52,26.34 19.52,20.52 20.27,19.77 20.27,17.99 20,17.72 v20,16
  Bottom 0.152: v13.7,31.75 13.6,31.85 13.6,33.72 12.82,34.5 v12.5,34.5 | U7.FPC5 19.16,15.16 v20,16
SCL  (via drill 0.2)
  Top 0.152: v12,7.08 11.98,7.1 U7.MEZ7 10.79,7.1 9.89,8 9.89,8.85 16.04,15 16.46,15 17,15.54 17,16.18 v17.41,16.59 | v10.48,5.83 10.33,5.68 8.82,5.68 7.97,4.83 v6.75,4.83 | ACCEL1.13 v6,6.5 | U1.2 23.5,30.75 24,30.25 | MDBT1.27 13.45,29.7 v13.25,29.5 12.87,29.12 12.87,26.96 14.45,25.38 14.45,23.93 16.52,21.86 16.52,20.34 16.88,19.99 16.88,18.62 v17.25,18.25 | v24,30.72 24,30.25 | 24,30.25 24,28.07 23.25,27.32 23.25,27 | v24.5,25.75 24.25,26 23.75,26 23.25,26.5 23.25,27 | R4.1 23.25,27 | U2.2 25.85,19.4 25,20.25 v25,21 24.86,21.15 24.86,21.4 24.5,21.75 v24.5,24.25
  Top 0.2: RTC.8 21.2,19.09 v21.05,18.95
  Bottom 0.152: v12,7.08 10.76,5.83 v10.48,5.83 | v6,6.5 6,6.19 6.25,5.94 6.25,5.32 v6.75,4.83 | v13.25,29.5 13.71,29.96 20.14,29.96 20.52,30.34 23.62,30.34 v24,30.72 | v17.41,16.59 17.41,18.09 v17.25,18.25 | v24.5,24.25 v24.5,25.75
  Bottom 0.2: v21.05,18.95 21.35,19.25 23.25,19.25 v25,21
SDA  (via drill 0.2)
  Top 0.152: v12,7.68 11.85,7.53 11.81,7.53 11.78,7.5 U7.MEZ8 10.82,7.5 10.2,8.12 10.2,8.72 16.17,14.7 16.59,14.7 17.3,15.41 17.3,15.84 v17.45,15.99 | v10.06,6.26 9.78,5.98 8.7,5.98 7.99,5.28 v7.42,5.28 | ACCEL1.14 5.9,7 v6,7.1 | U1.3 23.5,30.25 23.7,30.05 23.7,29.75 | 23.7,29.75 23.7,28.2 22.95,27.45 22.95,26.37 23.25,26.07 23.25,25 | R12.1 23.25,25 | MDBT1.29 14.08,30.5 | v23.4,29.75 23.7,29.75 | v16.87,17.78 16.72,17.93 16.72,18.06 16.57,18.21 16.57,19.86 16.22,20.21 16.22,21.74 14.15,23.81 14.15,25.25 12.56,26.83 12.56,29.56 13.5,30.5 14.08,30.5 | 23.25,25 23.25,24.5 24.05,23.7 v24.05,22.17 | RTC.7 21.39,20.36 v21,20.75 | v14.89,31.1 14.68,31.1 14.08,30.5
  Top 0.2: U2.1 26.25,19.46 25.48,20.23 25.48,21.24 24.95,21.76 v24.95,21.94
  Bottom 0.152: v12,7.68 11.85,7.53 11.81,7.53 11.55,7.26 11.55,7.05 10.78,6.29 10.09,6.29 v10.06,6.26 | v6,7.1 6.15,6.95 6.19,6.95 6.56,6.58 6.56,5.7 6.98,5.28 v7.42,5.28 | v23.4,29.75 23.75,29.75 24.45,30.45 24.45,30.91 24.19,31.18 23.81,31.18 23.29,30.65 20.4,30.65 20.01,30.27 15.71,30.27 v14.89,31.1 | v17.45,15.99 17.3,16.14 17.22,16.14 16.96,16.4 16.96,17.69 v16.87,17.78 | v24.05,22.17 24.05,21.25 | 24.05,21.25 23.75,20.96 21.21,20.96 v21,20.75 | v24.95,21.94 24.73,21.94 24.05,21.25
SWDCLK  (via drill 0.2)
  Top 0.152: MDBT1.53 6.1,33.84 6.71,34.45 8.2,34.45 v8.25,34.4
  Bottom 0.152: U$13.4 9.5,35.65 v8.25,34.4
SWDIO  (via drill 0.2)
  Top 0.152: MDBT1.51 6.9,33.75 v7.15,34
  Bottom 0.152: U$13.3 6.9,35.4 6.9,34.25 v7.15,34
SWO  (via drill 0.2)
  Top 0.152: MDBT1.47 8.9,31.3 v8.55,30.95
  Bottom 0.152: U$13.2 6.25,35.25 6.25,34.1 8.55,31.8 v8.55,30.95
SYSON_TPICLK  (via drill 0.2)
  Top 0.152: U8.1 v33.76,18 33.76,17.25 | R9.1 33.5,23.25 v34,23.75 | ISP1.3 30.57,33.8 | 30.57,33.8 32.7,33.8 v33,33.5 | U10.3 26.95,33.05 27.25,32.75 | 27.25,32.75 28.25,32.75 29.3,33.8 30.57,33.8 | 27.25,32.75 27,32.5 v27,32.25
  Top 0.3: U3.3 33.76,17.25
  Bottom 0.152: v33.76,18 34.51,18.75 34.51,23.25 34.26,23.5 | v34,23.75 34.26,23.5 | v33,33.5 34.26,32.24 34.26,23.5 | v27,32.25 27,33 25.5,34.5 24.75,34.5 22.75,36.5 SJ1.1
USBD+  (via drill 0.2)
  Top 0.152: U$1.A6 v6.97,15.65 7.42,15.65 8.22,16.45 RUSB+.2 | v4.8,15.25 U$1.B6
  Bottom 0.152: v4.8,15.25 5.2,15.65 v6.97,15.65
USBD-
  Top 0.152: RUSB-.2 8.1,14.2 7.15,15.15 U$1.A7 5.59,15.15 4.84,15.9 U$1.B7
VBAT  (via drill 0.2)
  Top 0.254: 23.25,15.25 23.25,14.46 23.94,13.78 U2.7 | RTC.6 24.11,21.64 24.5,21.25 24.5,19.96 v24.86,19.61
  Top 0.4: Q3.3 15.75,7.25 16.25,6.75 18.25,6.75 | 18.25,6.75 18.3,6.8 U9.3 | 18.25,6.75 20.93,6.75 21.26,7.08 22.75,7.08 | 22.75,7.08 26.89,7.08 27.33,7.51 27.33,7.83 28.38,8.88 28.5,9 30.4,9 v30.82,9.43 | 22.75,7.08 22.76,7.08 C13.2 | R1.1 23.25,15.25 23.42,15.25 v23.75,15.58
  Bottom 0.254: v24.86,19.61 24.86,16.2 25.5,15.55
  Bottom 0.4: v23.75,15.58 23.77,15.55 25.5,15.55 32.16,15.55 34.14,13.57 34.14,11.61 32.15,9.62 31.02,9.62 v30.82,9.43
VBAT_RAW  (via drill 0.2)
  Top 0.254: BAT1.P$1 32.2,10.45 32.6,10.85 | BAT1.P$6 33.8,12.05 33.4,11.65 | BAT1.P$7 33.4,11.65 | BAT1.P$2 32.6,10.85 | 32.6,10.85 33,11.25 33.4,11.65 | 24.65,13.13 24.65,13 v23.25,13 | 24.65,13.13 24.75,13.03 v24.75,12.78 | v24.25,18.75 U2.6 | C2.2 24.52,13 24.65,13.13 | U2.8 24.65,13.13 | v26,11.28 25,10.28 R6.2
  Top 0.4: 33.8,12.05 33,11.25 32.2,10.45 31.55,10.45 v31.3,10.2 | v23.25,13 23.25,13.75 22.75,14.25 R1.2
  Bottom 0.254: v24.25,18.75 24.25,17.04 23.25,16.04 23.25,15.37 23.61,15 25.25,15 24.75,14.5 v24.75,12.78 26,11.53 v26,11.28
  Bottom 0.4: v23.25,13 25.25,15 31.93,15 33.59,13.34 33.59,11.84 32.2,10.45 v31.8,10.45 31.55,10.45 v31.3,10.2
VBUS  (via drill 0.2)
  Top 0.254: 7.69,19.19 7.69,21.31 v6.25,22.75 | MDBT1.32 15.58,32.5 13.93,30.86 13.35,30.86 12.5,30 10.75,30 v10.5,29.75 | v7.69,17.26 7.08,16.65 U$1.A4 5.5,16.65 5.25,16.9 U$1.B9 | U$1.B4 5.29,13.9 5.54,14.15 U$1.A9 6.44,14.15 6.69,13.9 7.1,13.9 v7.5,13.5
  Top 0.3: U9.4 17.8,5.45 17.35,5 14.25,5
  Top 0.4: R8.2 14.25,4.25 | 14.25,4.25 D1.A | 14.25,4.25 14.25,5 13.5,5.75 | Q3.1 14.7,5.75 13.5,5.75 | 13.5,5.75 12,5.75 11.38,5.12 v11.5,5 11.38,5.12 11.01,4.75 C3.2 | C6.2 11.24,19.26 11,19.5 9.75,19.5 | R20.2 8.85,20.4 9.75,19.5 | 9.75,19.5 8,19.5 7.69,19.19 v7.69,17.26
  Bottom 0.254: v10.5,29.75 6.25,25.5 v6.25,22.75
  Bottom 0.3: v7.5,13.5 7.5,17.07 v7.69,17.26
  Bottom 0.4: v11.5,5 10.5,5 8.75,6.75 8.75,11.32 7.5,12.57 v7.5,13.5
VDIV  (via drill 0.2)
  Top 0.152: MDBT1.10 v10.9,23.35 | R6.1 v24,10.6 23.1,10.6 22.75,10.25 R7.2
  Bottom 0.152: v10.9,23.35 14.47,23.35 18.3,19.51 18.3,18.7 19.06,17.95 19.06,17.59 21.52,15.12 21.52,15 21.52,13 21.52,11.5 22.42,10.6 v24,10.6
VLED  (via drill 0.2)
  Top 0.3: v21.25,5 R11.1
  Bottom 0.3: v21.25,5 18.25,5 17.16,6.09 U7.FPC9
VSORS  (via drill 0.2, 0.35)
  Top 0.152: R9.2 32.75,21.25
  Top 0.3: 32.75,19.75 32.75,20.7 | U8.3 32.75,20.7 | 32.75,20.7 U8.4 | v34.25,14.5 33.1,14.5 32.35,15.25 | U3.1 33.75,15.25 32.35,15.25 | 32.75,19.75 U8.5 | C15.2 31,21.75 31.25,21.5 32.5,21.5 32.75,21.25 32.75,20.7 | 18.47,4 C7.2 | 32.75,19.75 32.75,19.25 32.17,18.67 32.17,16.87 31.89,16.58 31.89,15.92 32.1,15.7 32.1,15.5 32.35,15.25 | U4.5 31.05,5.2 v31.5,4.75 | v30.5,38.5 29.52,37.52 ISP1.2 | v25.5,38.25 25,37.75 | U10.5 26,37.5 25.75,37.75 25,37.75 | C14.2 23,35.51 23,37.25 23.5,37.75 23.75,37.75 | 23.75,37.75 25,37.75 | R15.1 23.75,37.75 | C9.1 33.81,33.06 v34,33.25
  Top 0.4: Q3.2 16.6,5.75 v16,5.75 | D1.K 17.03,4.25 17.25,4.47 v17.5,4.47 18,4.47 18.47,4
  Top 0.5: L1.1 35.05,4.8 v34.5,4.25 33.99,3.74 C17.2
  Bottom 0.3: v34.25,14.5 34.88,14.5 | 16.38,4.38 16.83,3.92 17.5,3.92 31.75,3.92 | 31.75,3.92 33,3.92 33.17,3.92 34.25,5 34.88,5.63 34.88,5.75 | v31.5,4.75 31.5,4.17 31.75,3.92 | 30.75,38.75 31.5,38.75 | 30.75,38.75 v30.5,38.5 30.25,38.75 | v25.5,38.25 26,38.75 30.25,38.75 | v34,33.25 34.38,33.25 34.68,33.55 | 30.25,38.75 30.75,38.75
  Bottom 0.4: v17.5,4.47 17.5,3.97 16.78,3.97 16.38,4.38 16,4.75 v16,5.75 | 17.5,3.92 33,3.92 33.05,3.92 34.88,5.75 34.88,14.5 34.88,18.52 34.93,18.57 34.93,23.42 34.68,23.67 34.68,33.55 34.68,36.57 32.5,38.75 31.5,38.75 30.25,38.75
  Bottom 0.5: v34.5,4.25 34.25,4.5 34.25,5
(copper drawn outside any net)
  shapes: Bottom area x1

### Text on the board
tPlace: U10 | U1 | U7 | BAT1 | U9 | U4